# EAGLE board TX16S_enhanced (EAGLE 7.7.0), part 1 of 3
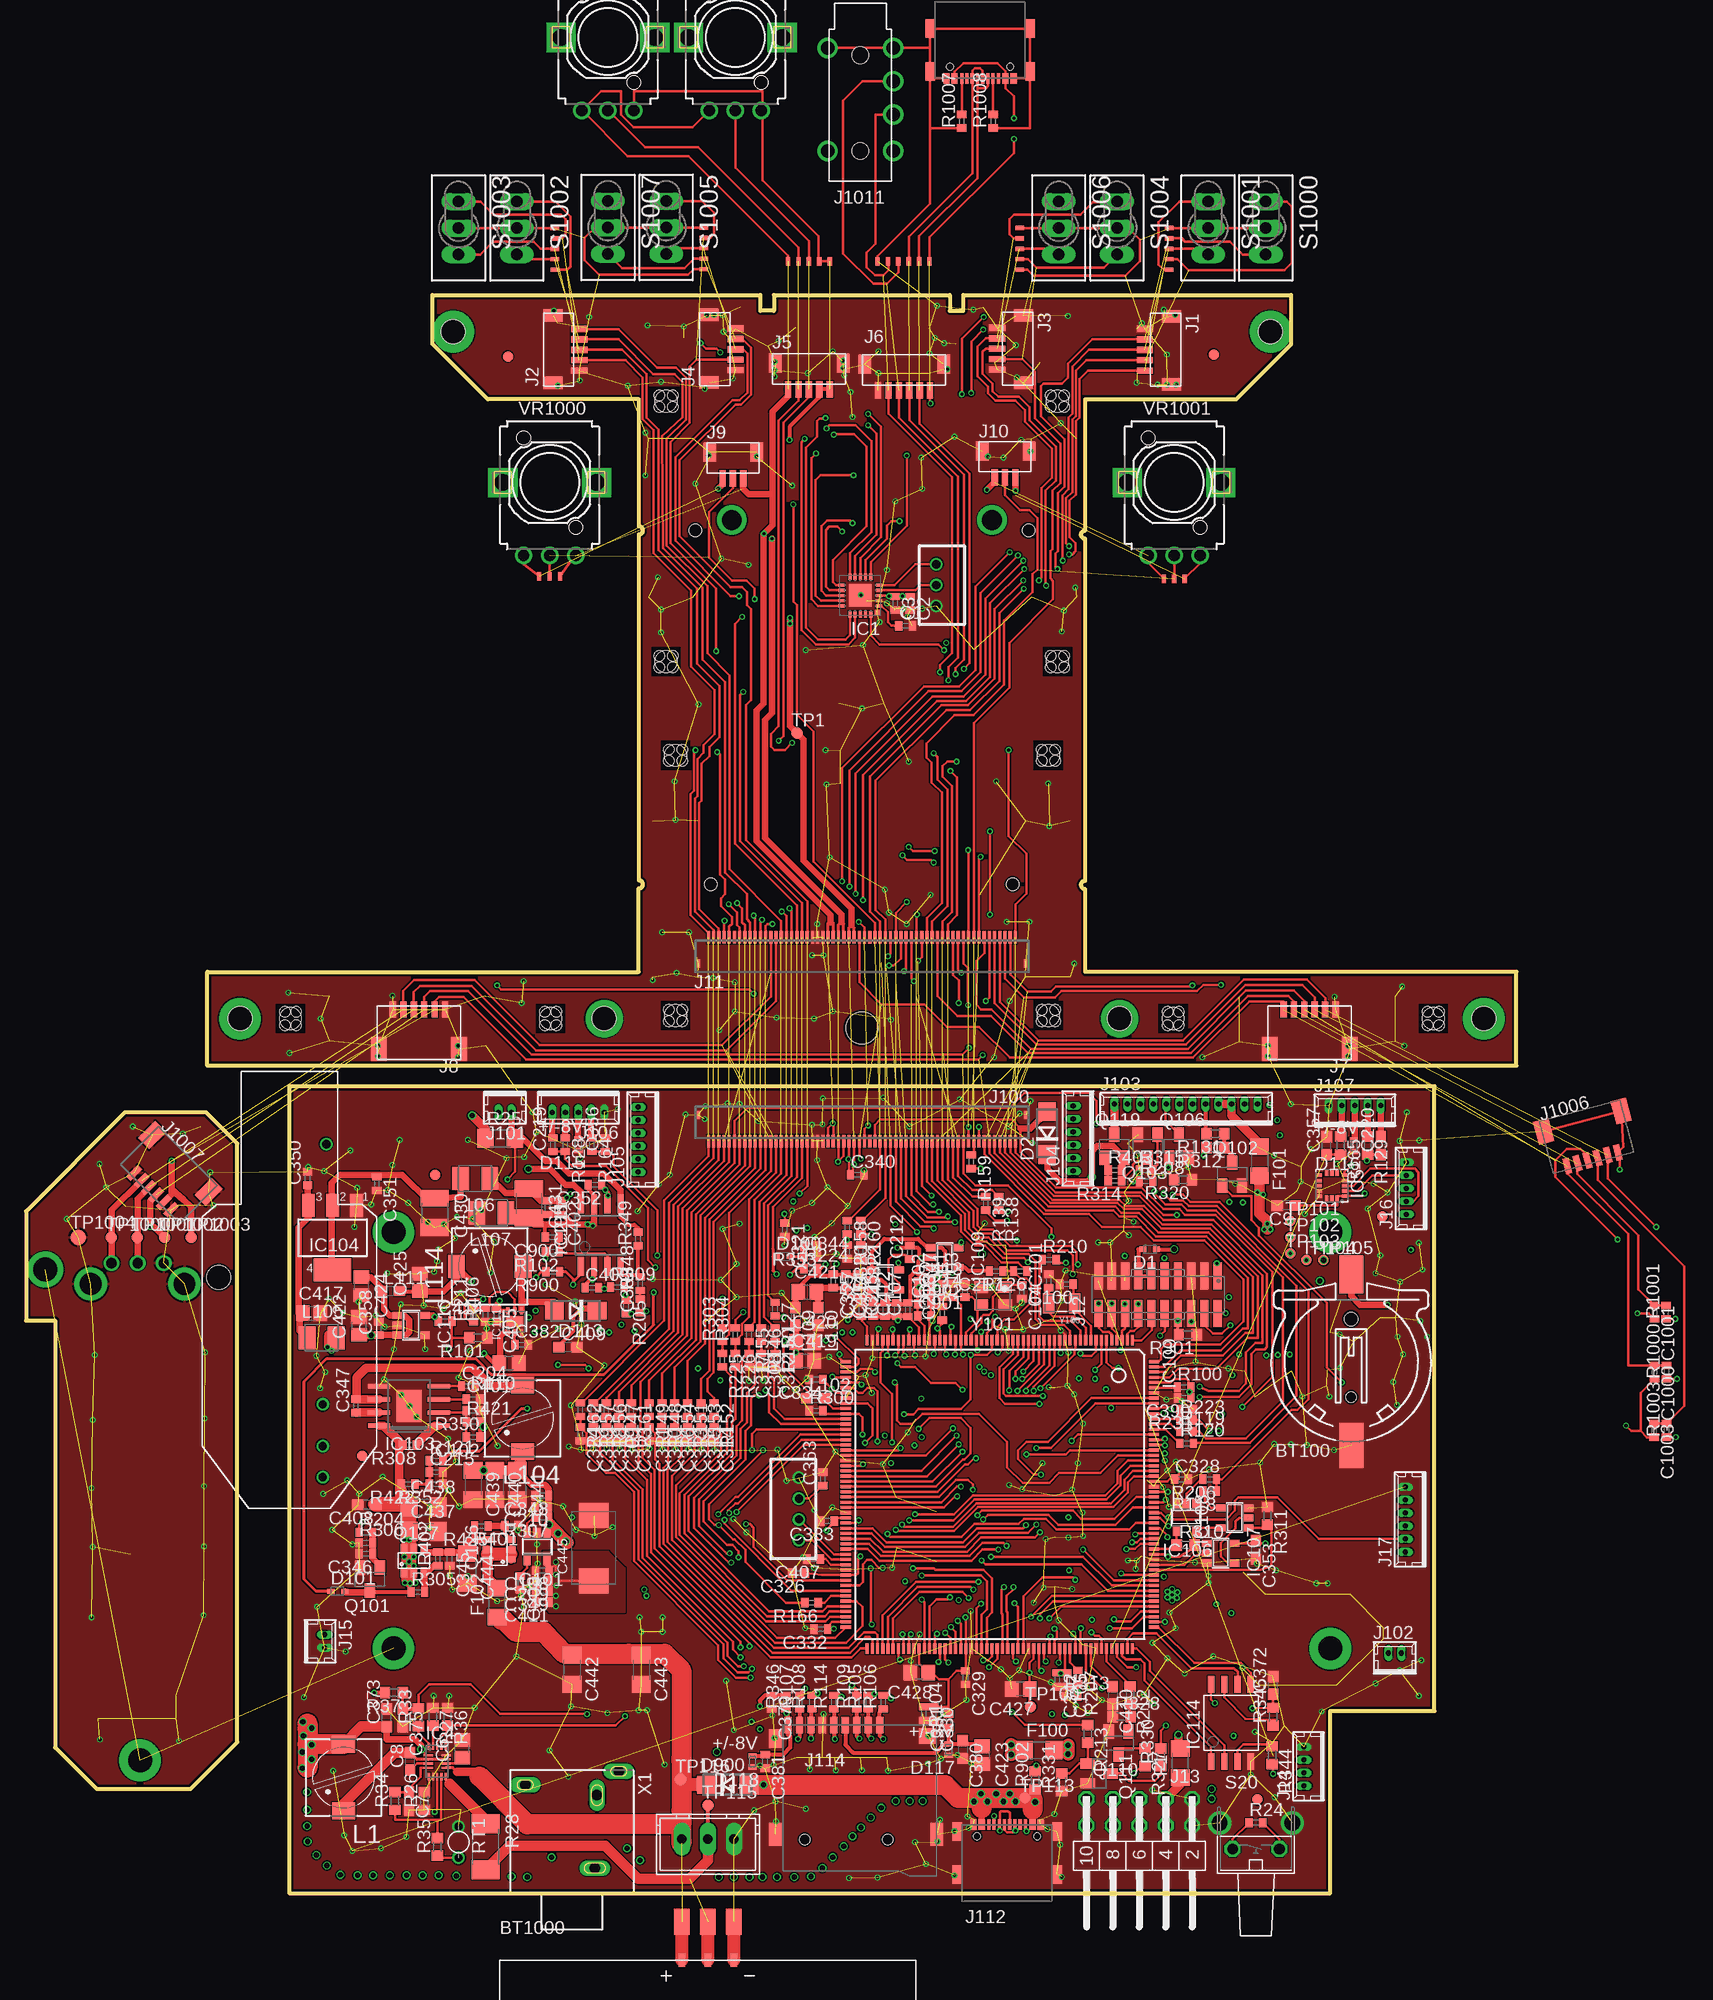
[diagram p5: board, top side]
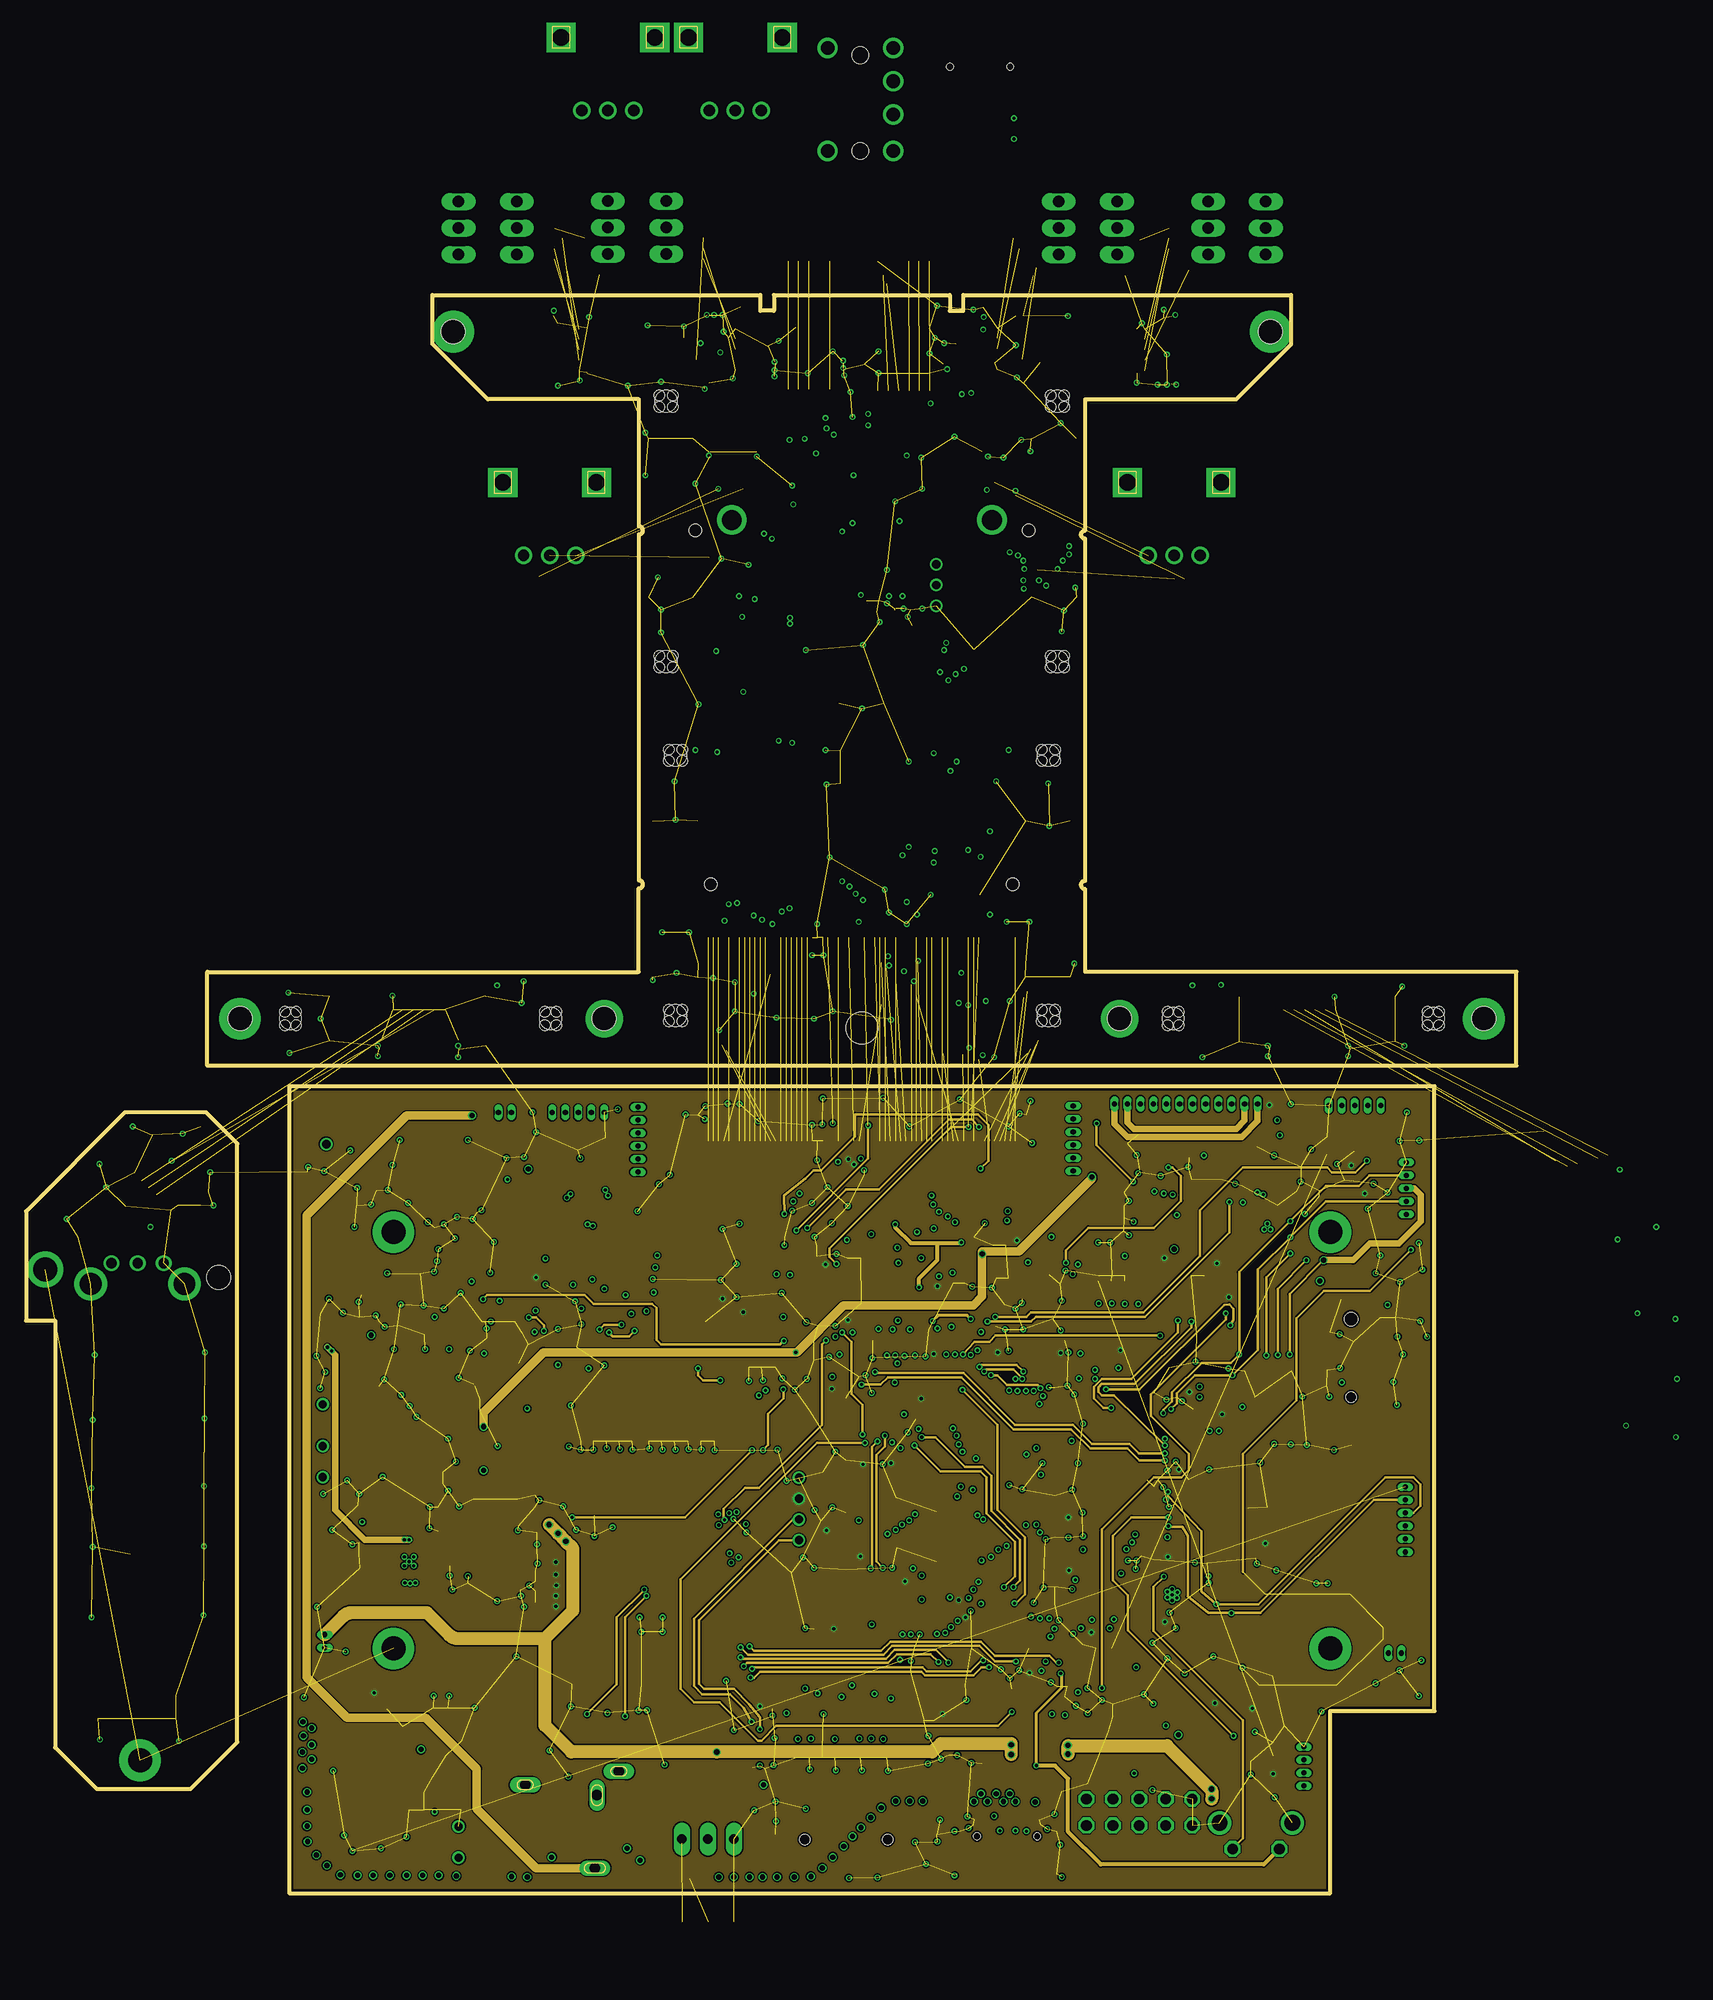
[diagram p6: board, inner layer Route2]
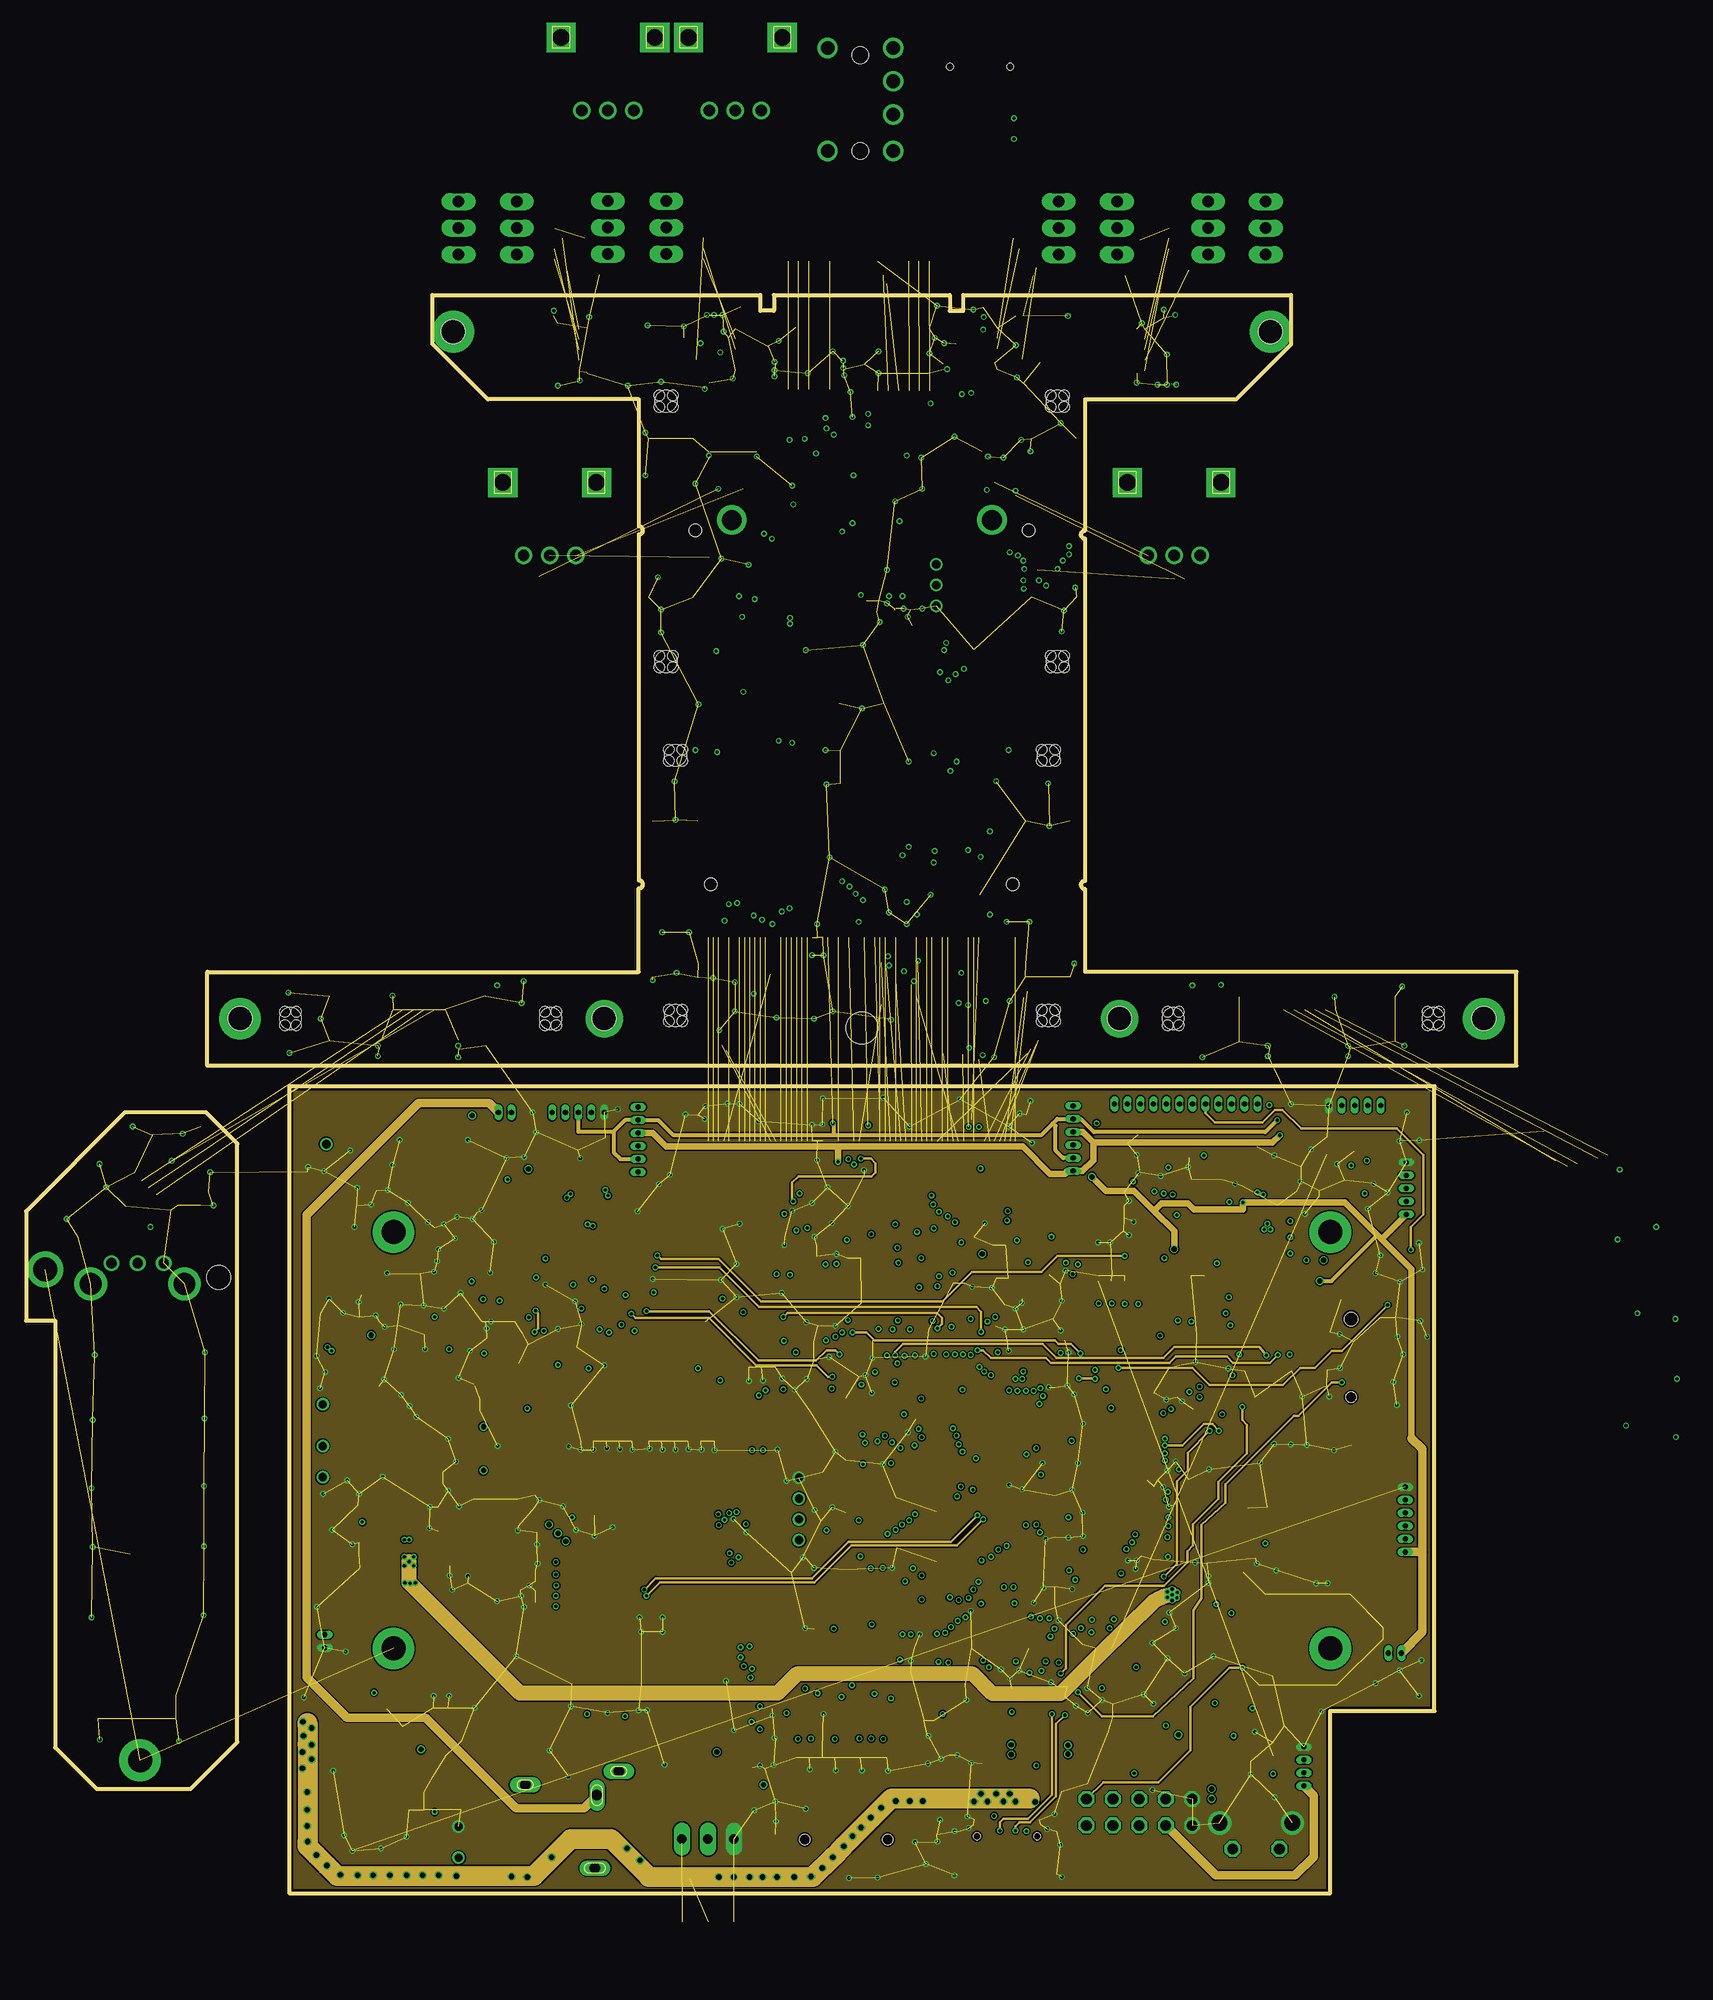
[diagram p7: board, inner layer Route3]
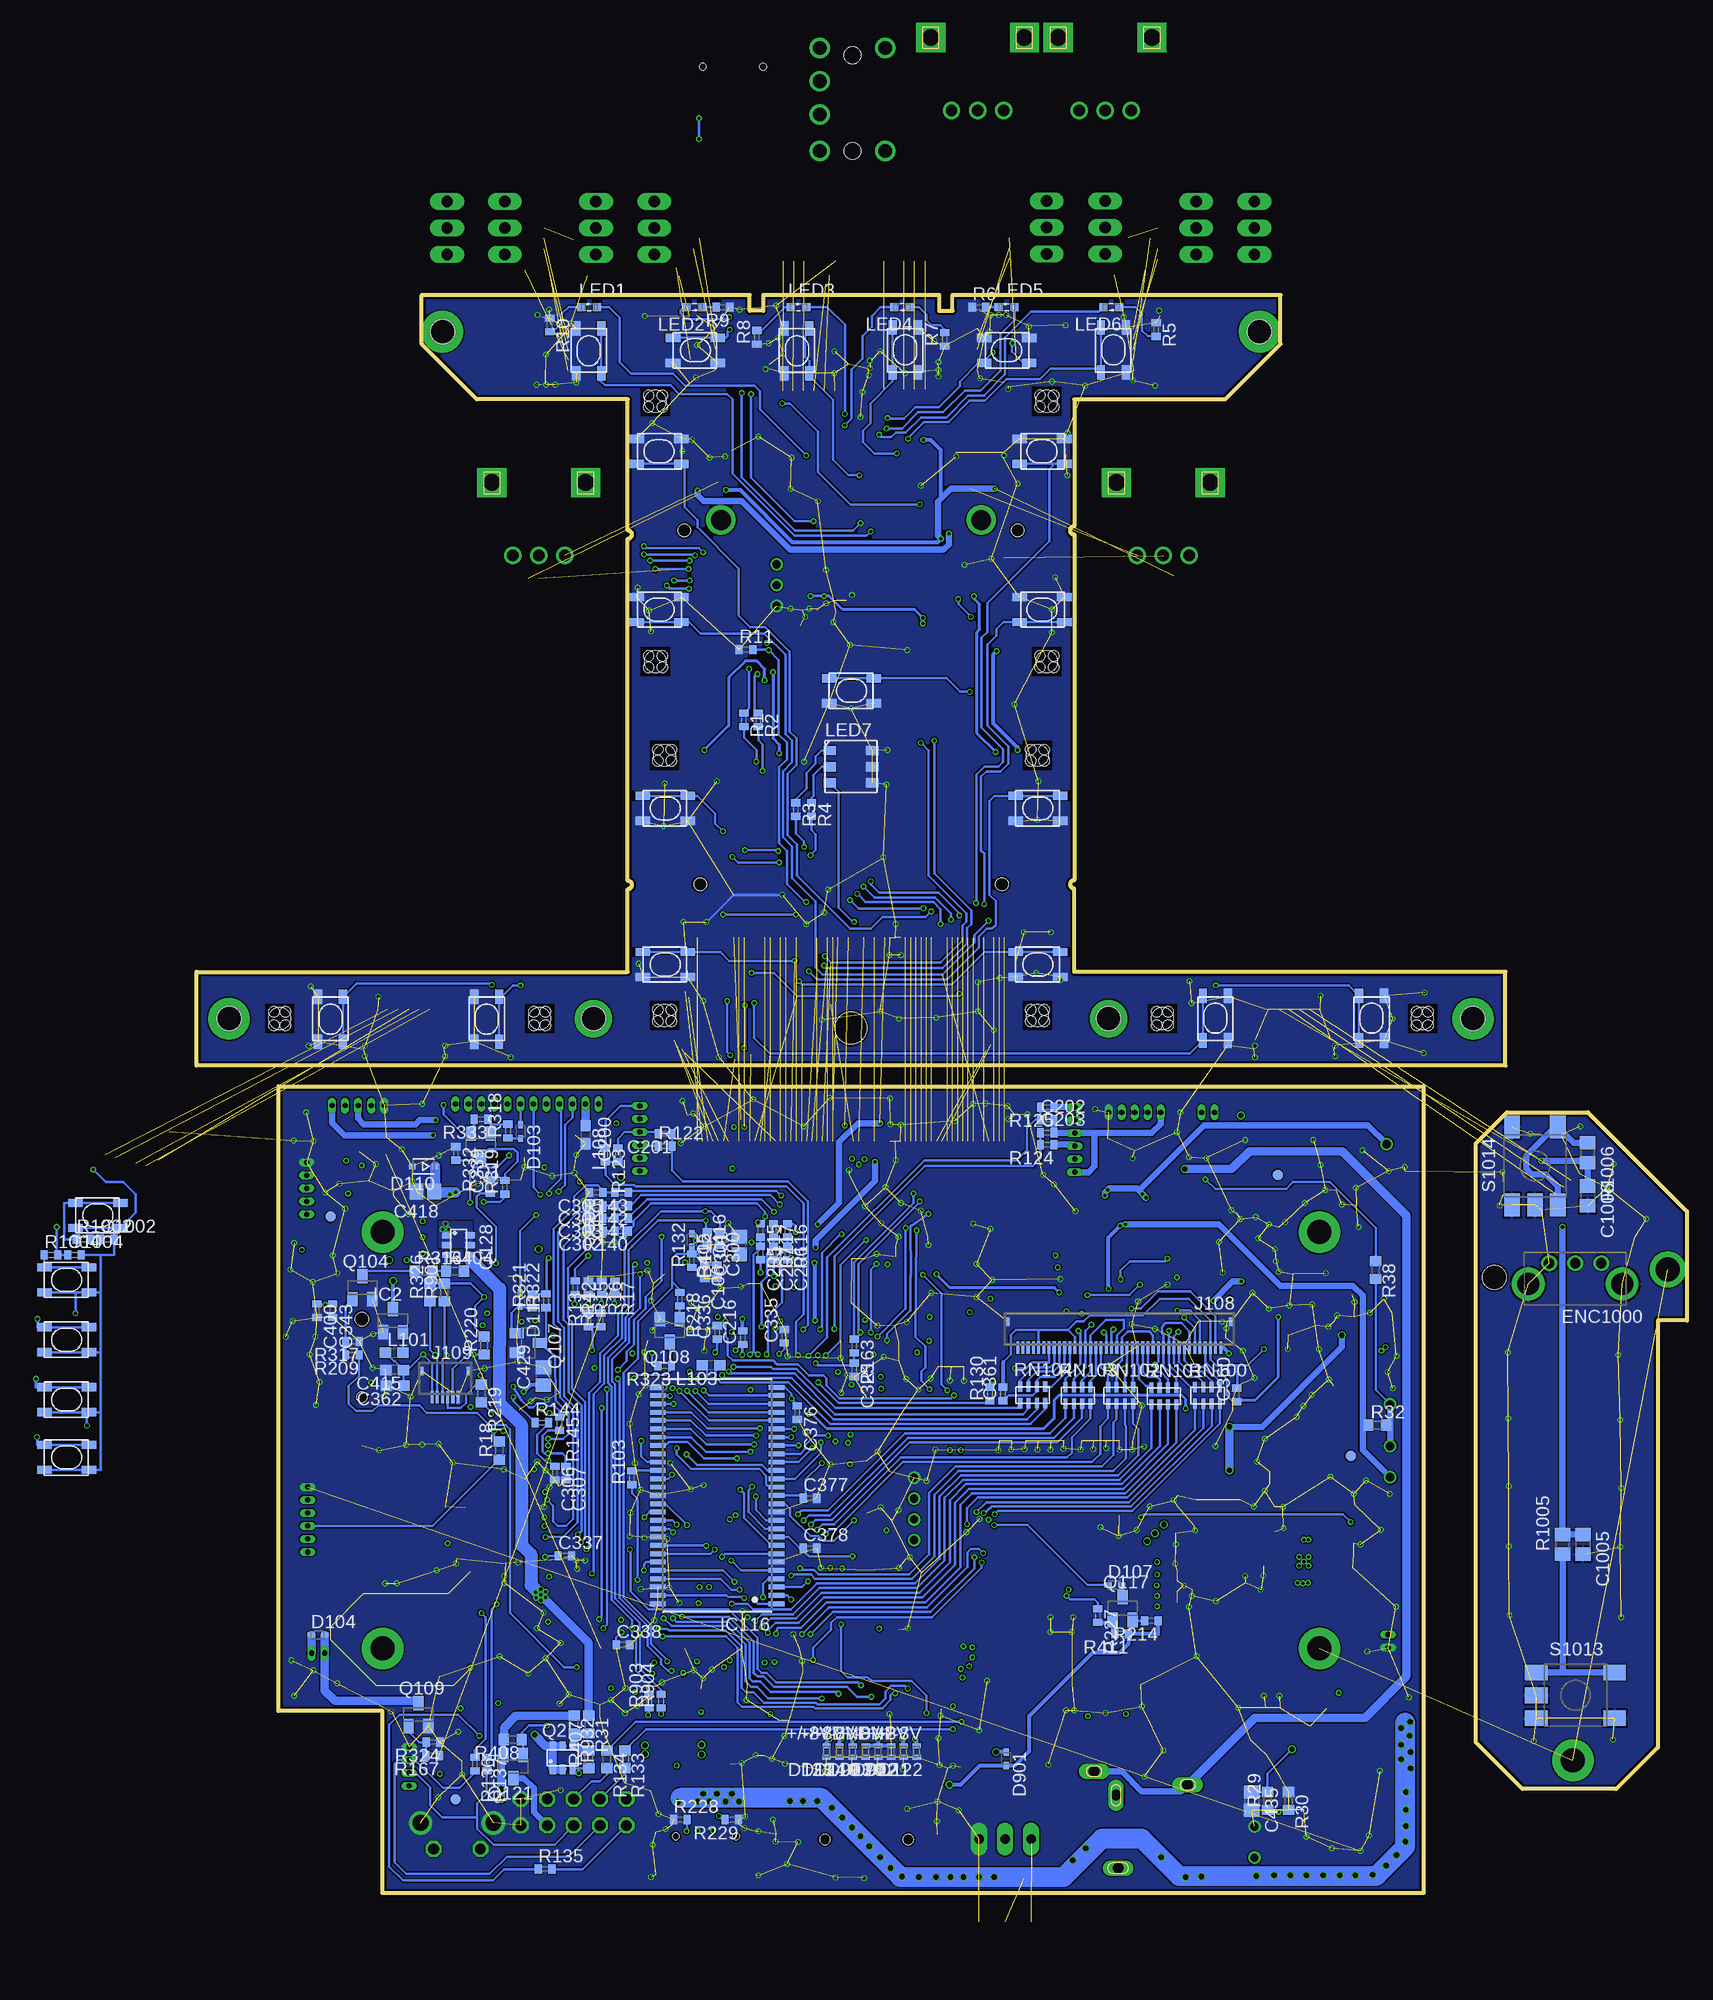
[diagram p8: board, bottom side, seen from below]

Size 143.18 x 153.5 mm. Coordinates in mm from the lower left corner, seen from the top.
Outline: 25.3,0 125.3,0 125.3,17.5 135.3,17.5 135.3,77.5 25.3,77.5 25.3,0
Outline: 17.43,79.5 143.18,79.5 143.18,88.5 101.75,88.5 101.75,96.45 arc-180 101.75,97.25 101.75,130.1 arc-180 101.75,130.9 101.75,143.5 116.25,143.5 121.55,148.8 121.55,153.5 90.05,153.5 90.05,152 88.75,152 88.75,153.5 71.85,153.5 71.85,152 70.55,152 70.55,153.5 39.05,153.5 39.05,148.8 44.35,143.5 58.85,143.5 58.85,131.3 arc-180 58.85,130.5 58.85,97.3 arc-180 58.85,96.5 58.85,88.5 17.43,88.5 17.43,79.5
Outline: 15.8,10 20.3,14.5 20.3,72 17.3,75 9.5,75 0,65.5 0,55 2.8,55 2.8,14 6.8,10 15.8,10
Copper layers (1+2*3+16): Top 0.035mm / dielectric 0.14mm / Route2 0.035mm / dielectric 1.2mm / Route3 0.035mm / dielectric 0.14mm / Bottom 0.035mm
Design rules "Multi-CB_4L_125um-Tracks_OL35um-IL35um *": minimum track width 0.125mm, minimum drill 0.2mm, track to track 0.125mm, track to pad 0.125mm, pad to pad 0.125mm, via to via 0.125mm, smd to smd 0mil, copper to edge 0.2mm, drill to drill 0.2mm, minimum pad ring 0.125mm, minimum via ring 0.125mm, stop-mask expansion 2mil, vias tented up to drill 0.45mm, thermal gap 0.2mm
Holes 2.3 mm at 20.55,84 55.55,84 105.05,84 140.05,84 41.05,150 119.55,150 18.5,59.15
Holes 2.1 mm at 25.4,84 50.4,84 110.2,84 135.2,84 62.4,84.3 62.4,109.3 98.2,84.3 98.2,109.3 61.5,118.3 61.5,143.3 99.1,118.3 99.1,143.3
Holes 3.1 mm at 80.3,83.1
Holes 1 mm at 24.85,84.65 25.95,84.65 25.95,83.35 24.85,83.35 49.85,84.65 49.85,83.35 50.95,84.65 50.95,83.35 109.65,84.65 109.65,83.35 110.75,84.65 110.75,83.35 134.65,84.65 134.65,83.35 135.75,83.35 135.75,84.65 61.75,83.75 61.75,84.85 63.05,84.85 63.05,83.75 98.85,84.85 98.85,83.75 97.55,84.85 97.55,83.75 61.75,109.85 63.05,109.85 61.75,108.75 63.05,108.75 97.55,109.85 97.55,108.75 98.85,109.85 98.85,108.75 60.85,118.85 60.85,117.75 62.15,118.85 62.15,117.75 98.45,118.85 98.45,117.75 99.75,117.75 99.75,118.85 60.85,143.85 60.85,142.75 62.15,143.85 62.15,142.75 98.45,143.85 98.45,142.75 99.75,143.85 99.75,142.75
Holes 1.2 mm at 64.3,130.9 96.3,130.9 65.8,96.9 94.8,96.9
tRestrict: area 24,82.6 to 26.8,85.4; area 133.8,82.6 to 136.6,85.4; area 49,82.6 to 51.8,85.4; area 108.8,82.6 to 111.6,85.4; area 61,82.9 to 63.8,85.7; area 96.8,82.9 to 99.6,85.7; area 61,107.9 to 63.8,110.7; area 96.8,107.9 to 99.6,110.7; area 60.1,116.9 to 62.9,119.7; area 97.7,116.9 to 100.5,119.7; area 60.1,141.9 to 62.9,144.7; area 97.7,141.9 to 100.5,144.7
bRestrict: area 24,82.6 to 26.8,85.4; area 133.8,82.6 to 136.6,85.4; area 49,82.6 to 51.8,85.4; area 108.8,82.6 to 111.6,85.4; area 61,82.9 to 63.8,85.7; area 96.8,82.9 to 99.6,85.7; area 61,107.9 to 63.8,110.7; area 96.8,107.9 to 99.6,110.7; area 60.1,116.9 to 62.9,119.7; area 97.7,116.9 to 100.5,119.7; area 60.1,141.9 to 62.9,144.7; area 97.7,141.9 to 100.5,144.7

## Footprints (pad centres in the part's own frame; a part is rotated, then mirrored left to right if it is on the bottom)
BT_KN330 = drill 0.8: +5V 3.55,35; GND 3.2,3; L 3.2,10; R 3.2,6
CH291-1220LF = smd 2.3 x 3.66: + 0,-2.296 | smd 2.3 x 4.3: - 0,14.146 | hole 1.3: 0,2 | hole 1: 0,9.5
BATTERY_2S_5000 = smd 0.635 x 1.27: 1 2.5,0; 2 0,0; 3 -2.5,0
C0402 = smd 0.7 x 0.9: 1 -0.65,0; 2 0.65,0
C2012 = smd 1.3 x 1.5: 1 -0.85,0; 2 0.85,0
C0603 = smd 1.1 x 1: 1 -0.85,0; 2 0.85,0
C3225 = smd 1.6 x 2.7: 1 -1.4,0; 2 1.4,0
C3216 = smd 1.6 x 1.8: 1 -1.4,0; 2 1.4,0
SMC_D = smd 2.4 x 2.8: + -3.15,0; - 3.15,0
C0805 = smd 1.3 x 1.5: 1 -0.95,0; 2 0.95,0
SOD523 = smd 0.7 x 0.5: A 0.7,0; C -0.6,0
DO-214AC = smd 1.8 x 1.7: A 2.05,0; C -2.05,0
SOD323-R = smd 0.6 x 0.6: A 1.1,0; C -1.1,0
DFN1006-2L = smd 0.8 x 0.5: P$1 0,0.55; P$2 0,-0.55
APLS_EC10E = drill 1: A -2.5,0; B 0,0; C 2.5,0 | drill 2.1: P$1 -4.5,2; P$2 4.5,2
1206 = smd 1.6 x 1.8: 1 -1.4,0; 2 1.4,0
FIDUCIAL = smd 1 x 1: P$1 0,0
MLP20 = smd 0.6 x 0.3: 1 -1.8,1; 2 -1.8,0.5; 3 -1.8,0; 4 -1.8,-0.5; 5 -1.8,-1; 11 1.8,-1; 12 1.8,-0.5; 13 1.8,0; 14 1.8,0.5; 15 1.8,1 | smd 0.3 x 0.6: 6 -1,-1.8; 7 -0.5,-1.8; 8 0,-1.8; 9 0.5,-1.8; 10 1,-1.8; 16 1,1.8; 17 0.5,1.8; 18 0,1.8; 19 -0.5,1.8; 20 -1,1.8 | smd 2.15 x 2.15: EXP 0,0 | smd 0.435 x 0.435: M -1.6,1.6
SOT-23 = smd 1 x 1.4: 1 -0.95,-1.1; 2 0.95,-1.1; 3 0,1.1
MP2672A = smd 0.889 x 0.203: 1 -0.85,0.6; 2 -0.85,0.2; 3 -0.85,-0.2; 4 -0.85,-0.6; 10 0.85,-0.6; 11 0.85,-0.2; 12 0.85,0.2; 13 0.85,0.6 | smd 0.203 x 0.711: 5 -0.8,-1.45; 6 -0.4,-1.45; 7 0,-1.45; 8 0.4,-1.45; 9 0.8,-1.45; 14 0.8,1.45; 15 0.4,1.45; 16 0,1.45; 17 -0.4,1.45; 18 -0.8,1.45
LGA_3X3_16L = smd 0.35 x 0.51: 1 1,1.21; 2 0.5,1.21; 3 0,1.21; 4 -0.5,1.21; 5 -1,1.21; 9 -1,-1.21; 10 -0.5,-1.21; 11 0,-1.21; 12 0.5,-1.21; 13 1,-1.21 | smd 0.51 x 0.35: 6 -1.21,0.5; 7 -1.21,0; 8 -1.21,-0.5; 14 1.21,-0.5; 15 1.21,0; 16 1.21,0.5
LQFP208 = smd 1 x 0.3: 1 -14.8,12.75; 2 -14.8,12.25; 3 -14.8,11.75; 4 -14.8,11.25; 5 -14.8,10.75; 6 -14.8,10.25; 7 -14.8,9.75; 8 -14.8,9.25; 9 -14.8,8.75; 10 -14.8,8.25; 11 -14.8,7.75; 12 -14.8,7.25; 13 -14.8,6.75; 14 -14.8,6.25; 15 -14.8,5.75; 16 -14.8,5.25; 17 -14.8,4.75; 18 -14.8,4.25; 19 -14.8,3.75; 20 -14.8,3.25; 21 -14.8,2.75; 22 -14.8,2.25; 23 -14.8,1.75; 24 -14.8,1.25; 25 -14.8,0.75; 26 -14.8,0.25; 27 -14.8,-0.25; 28 -14.8,-0.75; 29 -14.8,-1.25; 30 -14.8,-1.75; 31 -14.8,-2.25; 32 -14.8,-2.75; 33 -14.8,-3.25; 34 -14.8,-3.75; 35 -14.8,-4.25; 36 -14.8,-4.75; 37 -14.8,-5.25; 38 -14.8,-5.75; 39 -14.8,-6.25; 40 -14.8,-6.75; 41 -14.8,-7.25; 42 -14.8,-7.75; 43 -14.8,-8.25; 44 -14.8,-8.75; 45 -14.8,-9.25; 46 -14.8,-9.75; 47 -14.8,-10.25; 48 -14.8,-10.75; 49 -14.8,-11.25; 50 -14.8,-11.75; 51 -14.8,-12.25; 52 -14.8,-12.75; 105 14.8,-12.75; 106 14.8,-12.25; 107 14.8,-11.75; 108 14.8,-11.25; 109 14.8,-10.75; 110 14.8,-10.25; 111 14.8,-9.75; 112 14.8,-9.25; 113 14.8,-8.75; 114 14.8,-8.25; 115 14.8,-7.75; 116 14.8,-7.25; 117 14.8,-6.75; 118 14.8,-6.25; 119 14.8,-5.75; 120 14.8,-5.25; 121 14.8,-4.75; 122 14.8,-4.25; 123 14.8,-3.75; 124 14.8,-3.25; 125 14.8,-2.75; 126 14.8,-2.25; 127 14.8,-1.75; 128 14.8,-1.25; 129 14.8,-0.75; 130 14.8,-0.25; 131 14.8,0.25; 132 14.8,0.75; 133 14.8,1.25; 134 14.8,1.75; 135 14.8,2.25; 136 14.8,2.75; 137 14.8,3.25; 138 14.8,3.75; 139 14.8,4.25; 140 14.8,4.75; 141 14.8,5.25; 142 14.8,5.75; 143 14.8,6.25; 144 14.8,6.75; 145 14.8,7.25; 146 14.8,7.75; 147 14.8,8.25; 148 14.8,8.75; 149 14.8,9.25; 150 14.8,9.75; 151 14.8,10.25; 152 14.8,10.75; 153 14.8,11.25; 154 14.8,11.75; 155 14.8,12.25; 156 14.8,12.75 | smd 0.3 x 1: 53 -12.75,-14.8; 54 -12.25,-14.8; 55 -11.75,-14.8; 56 -11.25,-14.8; 57 -10.75,-14.8; 58 -10.25,-14.8; 59 -9.75,-14.8; 60 -9.25,-14.8; 61 -8.75,-14.8; 62 -8.25,-14.8; 63 -7.75,-14.8; 64 -7.25,-14.8; 65 -6.75,-14.8; 66 -6.25,-14.8; 67 -5.75,-14.8; 68 -5.25,-14.8; 69 -4.75,-14.8; 70 -4.25,-14.8; 71 -3.75,-14.8; 72 -3.25,-14.8; 73 -2.75,-14.8; 74 -2.25,-14.8; 75 -1.75,-14.8; 76 -1.25,-14.8; 77 -0.75,-14.8; 78 -0.25,-14.8; 79 0.25,-14.8; 80 0.75,-14.8; 81 1.25,-14.8; 82 1.75,-14.8; 83 2.25,-14.8; 84 2.75,-14.8; 85 3.25,-14.8; 86 3.75,-14.8; 87 4.25,-14.8; 88 4.75,-14.8; 89 5.25,-14.8; 90 5.75,-14.8; 91 6.25,-14.8; 92 6.75,-14.8; 93 7.25,-14.8; 94 7.75,-14.8; 95 8.25,-14.8; 96 8.75,-14.8; 97 9.25,-14.8; 98 9.75,-14.8; 99 10.25,-14.8; 100 10.75,-14.8; 101 11.25,-14.8; 102 11.75,-14.8; 103 12.25,-14.8; 104 12.75,-14.8; 157 12.75,14.8; 158 12.25,14.8; 159 11.75,14.8; 160 11.25,14.8; 161 10.75,14.8; 162 10.25,14.8; 163 9.75,14.8; 164 9.25,14.8; 165 8.75,14.8; 166 8.25,14.8; 167 7.75,14.8; 168 7.25,14.8; 169 6.75,14.8; 170 6.25,14.8; 171 5.75,14.8; 172 5.25,14.8; 173 4.75,14.8; 174 4.25,14.8; 175 3.75,14.8; 176 3.25,14.8; 177 2.75,14.8; 178 2.25,14.8; 179 1.75,14.8; 180 1.25,14.8; 181 0.75,14.8; 182 0.25,14.8; 183 -0.25,14.8; 184 -0.75,14.8; 185 -1.25,14.8; 186 -1.75,14.8; 187 -2.25,14.8; 188 -2.75,14.8; 189 -3.25,14.8; 190 -3.75,14.8; 191 -4.25,14.8; 192 -4.75,14.8; 193 -5.25,14.8; 194 -5.75,14.8; 195 -6.25,14.8; 196 -6.75,14.8; 197 -7.25,14.8; 198 -7.75,14.8; 199 -8.25,14.8; 200 -8.75,14.8; 201 -9.25,14.8; 202 -9.75,14.8; 203 -10.25,14.8; 204 -10.75,14.8; 205 -11.25,14.8; 206 -11.75,14.8; 207 -12.25,14.8; 208 -12.75,14.8
SOT23-5 = smd 0.69 x 0.99: 1 -0.95,-1.29; 2 0,-1.29; 3 0.95,-1.29; 4 0.95,1.3; 5 -0.95,1.3
HSOP-8 = smd 0.45 x 2.15: 1 -1.905,-2.875; 2 -0.635,-2.875; 3 0.635,-2.875; 4 1.905,-2.875; 5 1.905,2.875; 6 0.635,2.875; 7 -0.635,2.875; 8 -1.905,2.875 | smd 3.1 x 2.4: PAD 0,0
SOT-223 = smd 1.219 x 2.235: 1 -2.311,-3.099; 2 0,-3.099; 3 2.311,-3.099 | smd 3.6 x 2.2: 4 0,3.099
SOP-8 = smd 0.6 x 1.8: 1 -1.905,-3; 2 -0.635,-3; 3 0.635,-3; 4 1.905,-3; 5 1.905,3; 6 0.635,3; 7 -0.635,3; 8 -1.905,3
WSON6 = smd 0.32 x 0.66: 1 -0.65,-1.025; 2 0,-1.025; 3 0.65,-1.025; 4 0.65,1.025; 5 0,1.025; 6 -0.65,1.025 | smd 1.6 x 1: PAD 0,0
SOP-8_208MIL = smd 0.61 x 1.6: 1 -1.905,-3.7; 2 -0.635,-3.7; 3 0.635,-3.7; 4 1.905,-3.7; 5 1.905,3.7; 6 0.635,3.7; 7 -0.635,3.7; 8 -1.905,3.7
TSOP_II_54 = smd 0.477 x 1.517: 1 -10.4,-5.705; 2 -9.6,-5.705; 3 -8.8,-5.705; 4 -8,-5.705; 5 -7.2,-5.705; 6 -6.4,-5.705; 7 -5.6,-5.705; 8 -4.8,-5.705; 9 -4,-5.705; 10 -3.2,-5.705; 11 -2.4,-5.705; 12 -1.6,-5.705; 13 -0.8,-5.705; 14 0,-5.705; 15 0.8,-5.705; 16 1.6,-5.705; 17 2.4,-5.705; 18 3.2,-5.705; 19 4,-5.705; 20 4.8,-5.705; 21 5.6,-5.705; 22 6.4,-5.705; 23 7.2,-5.705; 24 8,-5.705; 25 8.8,-5.705; 26 9.6,-5.705; 27 10.4,-5.705; 28 10.4,5.705; 29 9.6,5.705; 30 8.8,5.705; 31 8,5.705; 32 7.2,5.705; 33 6.4,5.705; 34 5.6,5.705; 35 4.8,5.705; 36 4,5.705; 37 3.2,5.705; 38 2.4,5.705; 39 1.6,5.705; 40 0.8,5.705; 41 0,5.705; 42 -0.8,5.705; 43 -1.6,5.705; 44 -2.4,5.705; 45 -3.2,5.705; 46 -4,5.705; 47 -4.8,5.705; 48 -5.6,5.705; 49 -6.4,5.705; 50 -7.2,5.705; 51 -8,5.705; 52 -8.8,5.705; 53 -9.6,5.705; 54 -10.4,5.705
AT_1SH-A-05-XS = smd 0.6 x 1.55: 1 -2,-2; 2 -1,-2; 3 0,-2; 4 1,-2; 5 2,-2 | smd 1.2 x 1.8: G1 -3.2,0.525; G2 3.3,0.525
AT_1SH-A-06-XS = smd 0.6 x 1.55: 1 -2.5,-2; 2 -1.5,-2; 3 -0.5,-2; 4 0.5,-2; 5 1.5,-2; 6 2.5,-2 | smd 1.2 x 1.8: G1 -3.8,0.525; G2 3.8,0.525
AT_1SH-A-06-XR = smd 0.6 x 1.55: 1 -2.5,-2.275; 2 -1.5,-2.275; 3 -0.5,-2.275; 4 0.5,-2.275; 5 1.5,-2.275; 6 2.5,-2.275 | smd 1.5 x 2.3: G1 -3.85,1.5; G2 3.85,1.5
AT_1SH-A-03-XS = smd 0.6 x 1.55: 1 -1,-1; 2 0,-1; 3 1,-1 | smd 1.2 x 1.8: G1 -2.2,1.525; G2 2.3,1.525
CON-FFC-60-REV = smd 0.3 x 1.2: 1 14.75,1.8; 2 14.25,1.8; 3 13.75,1.8; 4 13.25,1.8; 5 12.75,1.8; 6 12.25,1.8; 7 11.75,1.8; 8 11.25,1.8; 9 10.75,1.8; 10 10.25,1.8; 11 9.75,1.8; 12 9.25,1.8; 13 8.75,1.8; 14 8.25,1.8; 15 7.75,1.8; 16 7.25,1.8; 17 6.75,1.8; 18 6.25,1.8; 19 5.75,1.8; 20 5.25,1.8; 21 4.75,1.8; 22 4.25,1.8; 23 3.75,1.8; 24 3.25,1.8; 25 2.75,1.8; 26 2.25,1.8; 27 1.75,1.8; 28 1.25,1.8; 29 0.75,1.8; 30 0.25,1.8; 31 -0.25,1.8; 32 -0.75,1.8; 33 -1.25,1.8; 34 -1.75,1.8; 35 -2.25,1.8; 36 -2.75,1.8; 37 -3.25,1.8; 38 -3.75,1.8; 39 -4.25,1.8; 40 -4.75,1.8; 41 -5.25,1.8; 42 -5.75,1.8; 43 -6.25,1.8; 44 -6.75,1.8; 45 -7.25,1.8; 46 -7.75,1.8; 47 -8.25,1.8; 48 -8.75,1.8; 49 -9.25,1.8; 50 -9.75,1.8; 51 -10.25,1.8; 52 -10.75,1.8; 53 -11.25,1.8; 54 -11.75,1.8; 55 -12.25,1.8; 56 -12.75,1.8; 57 -13.25,1.8; 58 -13.75,1.8; 59 -14.25,1.8; 60 -14.75,1.8 | smd 0.4 x 0.8: G1 -15.75,-0.7; G2 15.75,-0.7
FTSH-110 = smd 0.8 x 2.6: 1 5.715,1.8; 2 5.715,-1.8; 3 4.445,1.8; 4 4.445,-1.8; 5 3.175,1.8; 6 3.175,-1.8; 7 1.905,1.8; 8 1.905,-1.8; 9 0.635,1.8; 10 0.635,-1.8; 11 -0.635,1.8; 12 -0.635,-1.8; 13 -1.905,1.8; 14 -1.905,-1.8; 15 -3.175,1.8; 16 -3.175,-1.8; 17 -4.445,1.8; 18 -4.445,-1.8; 19 -5.715,1.8; 20 -5.715,-1.8
PH2.54-5W2 = drill 1.016 octagon: 1 -5.08,0; 2 -5.08,-2.54; 3 -2.54,0; 4 -2.54,-2.54; 5 0,0; 6 0,-2.54; 7 2.54,0; 8 2.54,-2.54; 9 5.08,0; 10 5.08,-2.54
MOLEX_53047-04 = drill 0.5 pad 0.698 long: 1 1.845,0; 2 0.595,0; 3 -0.655,0; 4 -1.905,0
MOLEX_53047-02 = drill 0.5 pad 0.698 long: 1 0.625,0; 2 -0.625,0
MOLEX_53047-05 = drill 0.5 pad 0.698 long: 1 2.5,0; 2 1.25,0; 3 0,0; 4 -1.25,0; 5 -2.5,0
MOLEX_53047-06 = drill 0.5 pad 0.698 long: 1 3.115,0; 2 1.865,0; 3 0.615,0; 4 -0.635,0; 5 -1.885,0; 6 -3.135,0
JST_B3B_PH-K-S = drill 0.8: 1 -2,0; 2 0,0; 3 2,0
CON-FFC-60 = smd 0.3 x 1.2: 1 -14.75,1.8; 2 -14.25,1.8; 3 -13.75,1.8; 4 -13.25,1.8; 5 -12.75,1.8; 6 -12.25,1.8; 7 -11.75,1.8; 8 -11.25,1.8; 9 -10.75,1.8; 10 -10.25,1.8; 11 -9.75,1.8; 12 -9.25,1.8; 13 -8.75,1.8; 14 -8.25,1.8; 15 -7.75,1.8; 16 -7.25,1.8; 17 -6.75,1.8; 18 -6.25,1.8; 19 -5.75,1.8; 20 -5.25,1.8; 21 -4.75,1.8; 22 -4.25,1.8; 23 -3.75,1.8; 24 -3.25,1.8; 25 -2.75,1.8; 26 -2.25,1.8; 27 -1.75,1.8; 28 -1.25,1.8; 29 -0.75,1.8; 30 -0.25,1.8; 31 0.25,1.8; 32 0.75,1.8; 33 1.25,1.8; 34 1.75,1.8; 35 2.25,1.8; 36 2.75,1.8; 37 3.25,1.8; 38 3.75,1.8; 39 4.25,1.8; 40 4.75,1.8; 41 5.25,1.8; 42 5.75,1.8; 43 6.25,1.8; 44 6.75,1.8; 45 7.25,1.8; 46 7.75,1.8; 47 8.25,1.8; 48 8.75,1.8; 49 9.25,1.8; 50 9.75,1.8; 51 10.25,1.8; 52 10.75,1.8; 53 11.25,1.8; 54 11.75,1.8; 55 12.25,1.8; 56 12.75,1.8; 57 13.25,1.8; 58 13.75,1.8; 59 14.25,1.8; 60 14.75,1.8 | smd 0.4 x 0.8: G1 -15.75,-0.7; G2 15.75,-0.7
MOLEX_53047-12 = drill 0.5 pad 0.698 long: 1 6.865,0; 2 5.615,0; 3 4.365,0; 4 3.115,0; 5 1.865,0; 6 0.615,0; 7 -0.635,0; 8 -1.885,0; 9 -3.135,0; 10 -4.385,0; 11 -5.635,0; 12 -6.885,0
CON-FFC-40 = smd 0.3 x 1.2: 1 -9.67,1.8; 2 -9.17,1.8; 3 -8.67,1.8; 4 -8.17,1.8; 5 -7.67,1.8; 6 -7.17,1.8; 7 -6.67,1.8; 8 -6.17,1.8; 9 -5.67,1.8; 10 -5.17,1.8; 11 -4.67,1.8; 12 -4.17,1.8; 13 -3.67,1.8; 14 -3.17,1.8; 15 -2.67,1.8; 16 -2.17,1.8; 17 -1.67,1.8; 18 -1.17,1.8; 19 -0.67,1.8; 20 -0.17,1.8; 21 0.33,1.8; 22 0.83,1.8; 23 1.33,1.8; 24 1.83,1.8; 25 2.33,1.8; 26 2.83,1.8; 27 3.33,1.8; 28 3.83,1.8; 29 4.33,1.8; 30 4.83,1.8; 31 5.33,1.8; 32 5.83,1.8; 33 6.33,1.8; 34 6.83,1.8; 35 7.33,1.8; 36 7.83,1.8; 37 8.33,1.8; 38 8.83,1.8; 39 9.33,1.8; 40 9.83,1.8 | smd 0.4 x 0.8: G1 -10.67,-0.7; G2 10.83,-0.7
CON-FFC-6 = smd 0.3 x 1.2: 1 -1.25,1.8; 2 -0.75,1.8; 3 -0.25,1.8; 4 0.25,1.8; 5 0.75,1.8; 6 1.25,1.8 | smd 0.4 x 0.8: G1 -2.25,-0.7; G2 2.25,-0.7
USB-C-16 = smd 0.3 x 1: A5 -1.25,3.47; A6 -0.25,3.47; A7 0.25,3.47; A8 1.25,3.47; B5 1.75,3.47; B6 0.75,3.47; B7 -0.75,3.47; B8 -1.75,3.47 | smd 0.914 x 1.778: G1 -4.8,-1.3; G2 -4.8,2.8; G3 4.8,-1.3; G4 4.8,2.8 | smd 0.6 x 1: GND -3.225,3.47; GND2 3.225,3.47; VBUS1 -2.45,3.47; VBUS2 2.45,3.47 | hole 0.65: -2.89,2.365; 2.89,2.365
JST_B3B-XH-A = drill 0.9 pad 1.6 long: 1 2.5,0; 2 0,0; 3 -2.5,0
TFWF1 = smd 0.7 x 1.6: 1 7.2,11; 2 6.1,11; 3 5,11; 4 3.9,11; 5 2.8,11; 6 1.7,11; 7 0.6,11; 8 -0.5,11; CD -1.6,11 | smd 1.2 x 1.8: G1 -2.8,9.7 | smd 1.6 x 1.5: G2 11.8,9.95 | smd 1.2 x 2.2: G3 -2.8,0.5; G4 12.7,0.5 | hole 1: 0,0; 8,0
JST_B4B_PH-K-S = drill 0.8: 1 -3,0; 2 -1,0; 3 1,0; 4 3,0
PADS_5_1MM = smd 0.406 x 0.813: 1 -2,0; 2 -1,0; 3 0,0; 4 1,0; 5 2,0
PADS_6_1MM = smd 0.406 x 0.813: 1 -2.5,0; 2 -1.5,0; 3 -0.5,0; 4 0.5,0; 5 1.5,0; 6 2.5,0
AT_1SH-A-06-XR-REV = smd 0.6 x 1.55: 1 2.5,-2.275; 2 1.5,-2.275; 3 0.5,-2.275; 4 -0.5,-2.275; 5 -1.5,-2.275; 6 -2.5,-2.275 | smd 1.5 x 2.3: G1 -3.85,1.5; G2 3.85,1.5
PADS_3_1MM = smd 0.406 x 0.813: 1 -1,0; 2 0,0; 3 1,0
PJ-313B = drill 1.3: 2A -3.15,9.9; 2B 3.15,9.9; 3 3.15,6.7; 4 3.15,3.5; 5A -3.15,0; 5B 3.15,0 | hole 1.6: 0,0; 0,9.2
JST_XHP-3 = smd 1.5 x 2.5: 1 -2.5,0; 2 0,0; 3 2.5,0
PIS2816 = smd 2.2 x 1.6: 1 0,3.2; 2 0,-3.2
0603 = smd 1.1 x 1: 1 -0.85,0; 2 0.85,0
L3225M = smd 1.6 x 2.2: 1 -1.4,0; 2 1.4,0
SML0603 = smd 0.8 x 0.8: A 0.75,0; C -0.75,0
PLCC-6 = smd 1.2 x 0.9: AB -2.05,1.55; AG -2.05,-1.55; AR -2.05,0; CB 2.05,1.55; CG 2.05,-1.55; CR 2.05,0
TSOP-6 = smd 0.6 x 0.95: 1 -0.95,-1.125; 2 0,-1.125; 3 0.95,-1.125; 4 0.95,1.125; 5 0,1.125; 6 -0.95,1.125
R0402 = smd 0.7 x 0.9: 1 -0.65,0; 2 0.65,0
R0603 = smd 1 x 1.1: 1 -0.85,0; 2 0.85,0
R1206 = smd 1.6 x 1.803: 1 -1.422,0; 2 1.422,0
R2010 = smd 1.8 x 2.7: 1 -2.2,0; 2 2.2,0
R0805 = smd 1.3 x 1.5: 1 -0.95,0; 2 0.95,0
EXB38V = smd 0.4 x 1: 1A 1.2,-0.8; 1B 1.2,0.8; 2A 0.4,-0.8; 2B 0.4,0.8; 3A -0.4,-0.8; 3B -0.4,0.8; 4A -1.2,-0.8; 4B -1.2,0.8
NTC_3MM = drill 0.8: P$1 -1.5,0; P$2 1.5,0
TX16S_BUTTON = smd 0.8 x 1.4: 1.1 -1.2,2.1; 1.2 -1.2,-2.2; 2.1 1.2,2.1; 2.2 1.2,-2.2
JTP1236B = drill 1.016 octagon: 1 -2.25,-2.5; 2 2.25,-2.5 | drill 1.499 pad 2.159: SH1 -3.5,0; SH2 3.5,0
TL3XPO = drill 1.1 pad 1.422 long: 1 -2.54,0; 2 0,0; 3 2.54,0
TX16S_BUTTON2 = smd 1.5 x 2.2: 1.1 -2.2,3.75; 1.2 -2.2,-3.75; 2.1 2.2,3.75; 2.2 2.2,-3.75; SH 0,-3.75
TP11R = smd 1.1 x 1.1: TP 0,0
TP10R = smd 1 x 1: TP 0,0
TP15R = smd 1.5 x 1.5: TP 0,0
EVUFXL = drill 1.1 pad 1.676: 1 -2.5,-7; 2 0,-7; 3 2.5,-7 | drill 1.6 pad 2.8 square: M1 4.5,0; M2 -4.5,0
KLBR4 = drill 1 pad 1.3 long: B -2.4,-3.5; S -2.2,3.5 | drill 1 pad 1.2 long: R -4.5,-5.8; T 4.5,-4.5
3215 = smd 1.1 x 1.9: 1 -1.25,0; 2 1.25,0
3225 = smd 1.3 x 1.1: 1 -1.15,-0.9; 2 1.15,-0.9; 3 1.15,0.8; 4 -1.15,0.8

## Placement (x,y rotation side)
A1  BT_KN330  [BT_KN330]  25.3,36.95 0 top
BT100  CR1220 coin cell  [CH291-1220LF]  127.3,57.15 180 top
BT1000  2 Cell Lithium Battery  [BATTERY_2S_5000]  65.5,-6.45 0 top  (outside the outline)
C1  100n  [C0402]  84.5,121.75 0 top
C2  100n  [C0402]  84.95,123.9 270 top
C3  10u  [C0402]  83.5,123.9 270 top
C6  4u7 LESR  [C2012]  41.9,13.85 90 top
C7  1u  [C0603]  36.8,8.85 270 top
C8  100n  [C0603]  36.9,12.65 90 top
C9  100n  [C0603]  121.05,66.05 180 top
C100  15p  [C0402]  99.95,58.5 180 top
C101  15p  [C0402]  98.25,58.8 90 top
C102  15p  [C0402]  42.95,43.8 180 top
C103  22p  [C0402]  90.2,57.9 90 top
C104  22p  [C0402]  95.65,57.75 270 top
C105  100p  [C0402]  100,20.5 270 top
C106  100p  [C0402]  94.35,59.7 270 bottom
C107  100p  [C0402]  84.7,56.05 90 top
C108  100p  [C0402]  49.6,31 180 top
C200  1n  [C0402]  102.7,70.9 90 bottom
C201  1n  [C0402]  98.15,72.95 180 bottom
C202  1n  [C0402]  61.45,74.3 0 bottom
C203  1n  [C0402]  61.45,73.05 0 bottom
C204  3n3  [C0402]  42.5,48.7 0 top
C205  10n  [C0402]  89,61.5 270 bottom
C206  10n  [C0402]  86.4,61.5 270 bottom
C207  10n  [C0402]  87.75,61.5 270 bottom
C208  10n  [C0402]  47.5,29.8 270 top
C209  10n  [C0402]  49.6,30 180 top
C210  10n  [C0402]  49.55,37.1 180 top
C211  10n  [C0402]  50.1,65.85 270 top
C212  10n  [C0402]  84.9,61.55 90 top
C213  10n  [C0402]  82.55,56.05 90 top
C214  10n  [C0402]  86.3,57.65 0 top
C215  10n  [C0402]  39.4,40.45 0 top
C216  10n  [C0402]  90.7,53.35 90 bottom
C217  10n  [C0402]  93.2,59.75 180 top
C218  10n  [C0402]  88,55.7 90 top
C219  10n  [C0402]  50.6,71.9 90 top
C220  10n  [C0603]  130.15,71.8 90 top
C300  100n  [C0402]  92.9,62.9 270 bottom
C301  100n  [C0402]  94.1,62.9 270 bottom
C302  100n  [C0402]  104.75,63.6 180 bottom
C303  100n  [C0402]  104.8,64.85 180 bottom
C304  100n  [C0402]  104.8,66.05 180 bottom
C305  100n  [C0402]  104.8,67.3 180 bottom
C306  100n  [C0402]  108.75,40.35 270 bottom
C307  100n  [C0402]  107.7,40.35 270 bottom
C308  100n  [C0402]  70.65,51.2 270 top
C309  100n  [C0402]  56.95,44.1 270 top
C310  100n  [C0402]  61.05,44.1 270 top
C311  100n  [C0402]  59.85,44.1 270 top
C312  100n  [C0402]  71.95,51.2 270 top
C313  100n  [C0402]  63.55,44.1 270 top
C314  100n  [C0402]  66.1,44.1 270 top
C315  100n  [C0402]  64.85,44.1 270 top
C316  100n  [C0402]  62.3,44.1 270 top
C317  100n  [C0402]  69.45,51.2 270 top
C318  100n  [C0402]  55.75,44.1 270 top
C319  100n  [C0402]  54.5,44.1 270 top
C320  100n  [C0402]  78.9,61.6 270 top
C321  100n  [C0402]  72.9,63.7 270 top
C322  100n  [C0402]  80.2,61.6 270 top
C323  100n  [C0402]  58.15,44.1 270 top
C324  100n  [C0402]  53.25,44.1 270 top
C325  100n  [C0402]  80,50.25 270 bottom
C326  100n  [C0402]  74.2,30.75 180 top
C327  100n  [C0402]  80.25,56.05 90 top
C328  100n  [C0402]  111,39.75 0 top
C329  100n  [C0402]  90.25,20.7 270 top
C330  100n  [C0402]  87.2,17.25 270 top
C331  100n  [C0402]  86.25,17.25 270 top
C332  100n  [C0402]  76.35,25.35 180 top
C333  100n  [C0402]  77,35.75 180 top
C334  100n  [C0402]  75.9,49.35 180 top
C335  100n  [C0402]  86.7,53.5 90 bottom
C336  100n  [C0402]  93.15,53.85 90 bottom
C337  100n  [C0402]  107.8,32.4 0 bottom
C338  100n  [C0402]  102.2,23.85 0 bottom
C339  100n  [C0402]  114.95,67.85 90 bottom
C340  100n  [C0402]  79.85,69 0 top
C341  100n  [C0402]  89.05,57.9 90 top
C342  100n  [C0402]  99.05,20.5 270 top
C343  100n  [C0402]  130.1,55.95 270 bottom
C344  100n  [C0402]  75.35,61.15 0 top
C345  100n  [C0402]  40.7,32.1 270 top
C346  100n  [C0402]  32.65,32.6 180 top
C347  100n  [C0402]  31.7,46.8 90 top
C348  100n  [C0402]  49.55,38.2 180 top
C349  100n  [C0402]  49.6,29 180 top
C350  100n  [C0402]  27.05,68.65 90 top
C351  100n  [C0402]  33.7,68.15 270 top
C352  100n  [C0402]  54.65,68.05 180 top
C353  100n  [C0603]  118.15,33 270 top
C354  100n  [C0402]  81.4,56.05 90 top
C355  100n  [C0402]  77.55,58.8 270 top
C356  100n  [C0402]  55.65,71.9 90 top
C357  100n  [C0603]  124.95,71.8 90 top
C358  100n  [C0402]  33.9,54.25 90 top
C360  100n  [C0402]  43.25,47.85 90 bottom
C361  100n  [C0402]  65.7,47.95 90 bottom
C362  100n  [C0603]  124.1,48.75 180 bottom
C363  100n  [C0402]  76.55,39.8 90 top
C372  100n  [C0603]  119.8,19.95 90 top
C373  100n  [C0603]  34.65,16.85 90 top
C375  100n  [C0603]  36.2,16.85 270 top
C376  100n  [C0402]  85.45,46.15 270 bottom
C377  100n  [C0402]  84.25,37.95 0 bottom
C378  100n  [C0402]  84.25,33.15 0 bottom
C379  100n  [C0402]  71.65,18.35 270 top
C380  100n  [C0603]  90,13.8 270 top
C381  100n  [C0402]  71,12.65 270 top
C382  220n  [C0402]  47.6,52.7 0 top
C383  470n  [C0402]  59,56.4 90 top
C390  100n  [C0402]  111.25,47.6 180 top
C400  1u  [C0402]  131.6,55.95 270 bottom
C401  1u  [C0402]  42.95,47.45 0 top
C402  1u  [C0402]  51.4,65.85 270 top
C403  1u  [C0402]  54.35,58.15 0 top
C404  1u  [C0402]  78.75,58.8 270 top
C405  1u  [C0402]  45.2,55.55 270 top
C407  2u2  [C0402]  75.65,32.1 180 top
C408  2u2 LESR  [C0603]  32.75,37.3 180 top
C409  2u2 LESR  [C0603]  52.05,52.45 0 top
C410  4u7  [C0603]  104.4,19 270 top
C411  4u7  [C0402]  49.6,27.95 180 top
C412  4u7  [C0402]  83.65,56.05 90 top
C413  4u7  [C0402]  86.3,58.7 0 top
C414  4u7  [C0402]  40.25,54.95 0 top
C415  4u7  [C0603]  124.15,50.25 180 bottom
C416  4u7 LESR  [C2012]  91.05,62.2 90 bottom
C417  4u7 LESR  [C2012]  27.45,55.7 0 top
C418  4u7 LESR  [C2012]  121.2,67.4 180 bottom
C419  4u7 LESR  [C2012]  74.85,51.15 0 top
C420  4u7 LESR  [C2012]  74.85,52.95 0 top
C421  4u7 LESR  [C2012]  75.05,57.75 0 top
C422  4u7 LESR  [C2012]  32,54.5 90 top
C423  4u7 LESR  [C2012]  91.85,13.25 270 top
C424  10u  [C2012]  32.2,58.3 270 top
C425  10u  [C2012]  37.85,58.65 90 top
C427  16u  [C2012]  95.55,19.6 180 top
C428  16u  [C2012]  85.8,21.2 180 top
C429  16u  [C2012]  109.85,49.65 90 bottom
C430  100u  [C3225]  39.25,65.35 270 top
C431  100u  [C3225]  48.3,66.25 270 top
C435  16u  [C2012]  41.8,8.85 270 bottom
C437  22u  [C3216]  38.2,34.75 0 top
C438  22u  [C3216]  38.2,37.1 0 top
C439  22u  [C3216]  42.95,39.2 270 top
C440  22u  [C3216]  45.05,39.2 270 top
C441  22u  [C3216]  47.2,39.2 270 top
C442  22u  [C3216]  52.45,21.45 270 top
C443  22u  [C3216]  59.1,21.45 270 top
C444  47u  [C3216]  42.4,31.2 270 top
C445  100u  [SMC_D]  54.55,33.15 90 top
C900  DNP  [C0402]  50.55,63 180 top
C901  DNP  [C0402]  86.3,55.45 0 top
C902  DNP  [C0402]  86.3,56.6 0 top
C1000  100n  [C0402]  156.45,50.05 270 top  (outside the outline)
C1001  100n  [C0402]  156.45,55.8 270 top  (outside the outline)
C1002  100n  [C0402]  151.75,62.8 0 bottom  (outside the outline)
C1003  100n  [C0402]  156.4,44.45 270 top  (outside the outline)
C1004  100n  [C0402]  154.9,61.3 0 bottom  (outside the outline)
C1005  100n  [C0805]  9.99,33.5 270 bottom
C1006  100n  [C0805]  9.54,66.98 270 bottom
D1  ?  [SOD523]  108,61.85 180 top
D2  SS14  [DO-214AC]  98.1,73 90 top
D100  1N4148XHE3  [SOD523]  72.7,61.15 0 top
D101  1N4148XHE3  [SOD523]  29.9,29 0 top
D103  1SS389  [SOD523]  112.05,73.2 270 bottom
D104  1N4148XHE3  [SOD523]  131.55,24.8 0 bottom
D107  1SS389  [SOD523]  55,29.6 0 bottom
D110  BAR63-03W  [SOD323-R]  121.35,69.8 180 bottom
D111  ?  [SOD523]  112.1,57.05 270 bottom
D112  ?  [SOD523]  95.6,62.75 270 bottom
D113  SS14  [DO-214AC]  52.8,55.95 180 top
D115  +/-8V  [DFN1006-2L]  53.05,71.9 180 top
D116  +/-8V  [DFN1006-2L]  127.55,71.8 180 top
D117  +/-8V  [DFN1006-2L]  88.65,13.8 180 top
D118  +/-8V  [DFN1006-2L]  69.8,12.65 180 top
D119  +/-8V  [DFN1006-2L]  80.15,13.6 180 bottom
D120  +/-8V  [DFN1006-2L]  77.7,13.6 180 bottom
D121  +/-8V  [DFN1006-2L]  75.25,13.6 180 bottom
D122  +/-8V  [DFN1006-2L]  74,13.6 180 bottom
D123  +/-8V  [DFN1006-2L]  82.65,13.6 180 bottom
D124  +/-8V  [DFN1006-2L]  81.4,13.6 180 bottom
D900  DNP  [DO-214AC]  67.4,10.4 0 top
D901  DNP  [SOD523]  65.4,12.95 270 bottom
D902  DNP  [DFN1006-2L]  76.45,13.6 180 bottom
D903  DNP  [DFN1006-2L]  78.9,13.6 180 bottom
ENC1000  ALPS EC10E1220503  [APLS_EC10E]  10.72,60.53 180 bottom
F1  1A  [1206]  110.9,12.5 90 top
F100  500mA  [1206]  97.35,13.75 0 top
F101  1A  [1206]  118.5,70.3 270 top
F102  1A5  [1206]  45.25,27.9 90 top
FD1  [FIDUCIAL]  46.3,147.6 0 top
FD2  [FIDUCIAL]  114.1,147.8 0 top
FD100  [FIDUCIAL]  39.3,69 0 top
FD101  [FIDUCIAL]  32.3,42 0 top
FD102  [FIDUCIAL]  118.3,9 0 top
FD103  [FIDUCIAL]  130.3,65 0 top
FD104  [FIDUCIAL]  39.3,69 0 bottom
FD105  [FIDUCIAL]  32.3,42 0 bottom
FD106  [FIDUCIAL]  130.3,65 0 bottom
FD107  [FIDUCIAL]  118.3,9 0 bottom
IC1  C8051F330  [MLP20]  80.15,124.65 180 top
IC2  XC6202P332  [SOT-23]  124.3,55 0 bottom
IC4  MP2672AGD  [MP2672A]  39.5,12.65 0 top
IC5  LSM6DS33  [LGA_3X3_16L]  125.45,67.95 270 top
IC100  STM32F439BIT6  [LQFP208]  93.55,38.3 270 top
IC101  SGM2028-3.3  [SOT23-5]  49.1,33.3 180 top
IC102  SGM2028-3.3  [SOT23-5]  82.55,58.9 270 top
IC103  TPS54228DDA  [HSOP-8]  36.8,46.8 90 top
IC104  AMS1117-5.0  [SOT-223]  29.45,62.95 180 top
IC105  8002A  [SOP-8]  55.2,63.2 0 top
IC106  74LVC1G04DBV  [SOT23-5]  111.45,36.1 180 top
IC107  74LVC1G04DBV  [SOT23-5]  114.75,32.65 270 top
IC108  74LVC1G126DBV  [SOT23-5]  116.1,36.05 90 top
IC109  TLV70033DDC  [SOT23-5]  88.25,61.05 270 top
IC110  TLV70033DDC  [SOT23-5]  37,54.55 270 top
IC111  TPS61161DRV  [WSON6]  46.95,54.9 0 top
IC114  GD25Q127C  [SOP-8_208MIL]  115.75,16.35 0 top
IC116  W9864G6KH-6  [TSOP_II_54]  93.15,38.2 90 bottom
J1  1SH-A-05-GS  [AT_1SH-A-05-XS]  109.5,148.25 270 top
J2  1SH-A-05-GS  [AT_1SH-A-05-XS]  51.15,148.25 90 top
J3  1SH-A-05-GS  [AT_1SH-A-05-XS]  95.3,148.35 270 top
J4  1SH-A-05-GS  [AT_1SH-A-05-XS]  66.15,148.3 90 top
J5  1SH-A-05-GS  [AT_1SH-A-05-XS]  75.2,146.45 0 top
J6  1SH-A-06-GS  [AT_1SH-A-06-XS]  84.35,146.35 0 top
J7  1SH-A-06-XR  [AT_1SH-A-06-XR]  123.3,82.6 180 top
J8  1SH-A-06-XR  [AT_1SH-A-06-XR]  37.75,82.6 180 top
J9  1SH-A-03-GS  [AT_1SH-A-03-XS]  67.9,136.9 0 top
J10  1SH-A-03-GS  [AT_1SH-A-03-XS]  94.05,137 0 top
J11  ZIF FFC 60  [CON-FFC-60-REV]  80.3,90 0 top
J12  FTSH-110-01-L-DV-007-K  [FTSH-110]  108.75,57.5 0 top
J13  0.1" 2x5-pin 90°  [PH2.54-5W2]  106.95,6.5 180 top
J14  53047-04  [MOLEX_53047-04]  122.75,12.2 90 top
J15  53047-02  [MOLEX_53047-02]  28.7,24.2 270 top
J16  53047-05  [MOLEX_53047-05]  132.6,67.7 90 top
J17  53047-06  [MOLEX_53047-06]  132.5,35.9 90 top
J90  B3B-PH-K-S DNP  [JST_B3B_PH-K-S]  87.45,125.65 90 top
J100  ZIF FFC 60  [CON-FFC-60]  80.3,74.05 180 top
J101  53047-02  [MOLEX_53047-02]  46,75 180 top
J102  53047-02  [MOLEX_53047-02]  131.5,23.05 0 top
J103  53047-12  [MOLEX_53047-12]  111.45,75.8 0 top
J104  53047-06  [MOLEX_53047-06]  100.6,72.5 90 top
J105  53047-06  [MOLEX_53047-06]  58.8,72.4 90 top
J106  53047-05  [MOLEX_53047-05]  53.05,75 180 top
J107  53047-05  [MOLEX_53047-05]  127.65,75.65 0 top
J108  ZIF FFC 40  [CON-FFC-40]  54.45,54.2 180 bottom
J109  ZIF FFC 6  [CON-FFC-6]  119.3,49.45 180 bottom
J112  USB-C-16  [USB-C-16]  94.25,3.1 0 top
J113  B3B-XH-A  [JST_B3B-XH-A]  65.5,5.2 0 top
J114  TFWF1  [TFWF1]  74.8,5.15 0 top
J904  B4B-PH-K-S DNP  [JST_B4B_PH-K-S]  74.25,36.9 270 top
J1000  1CH-A-05  [PADS_5_1MM]  109.8,157.95 270 top
J1001  1CH-A-05  [PADS_5_1MM]  50.8,157.95 270 top
J1002  1CH-A-05  [PADS_5_1MM]  95.45,157.95 270 top
J1003  1CH-A-05  [PADS_5_1MM]  65.1,158 270 top
J1004  1CH-A-05  [PADS_5_1MM]  75.2,156.75 0 top  (outside the outline)
J1005  1CH-A-06  [PADS_6_1MM]  84.3,156.75 0 top  (outside the outline)
J1006  1SH-A-06-XR  [AT_1SH-A-06-XR-REV]  149.9,72.7 15 top
J1007  1SH-A-06-XR  [AT_1SH-A-06-XR-REV]  13.77,69.02 315 top
J1008  1CH-A-03  [PADS_3_1MM]  50.3,126.5 0 top
J1009  1CH-A-03  [PADS_3_1MM]  110.3,126.25 0 top
J1010  USB-C-16  [USB-C-16]  91.65,177.8 180 top  (outside the outline)
J1011  PJ-313B  [PJ-313B]  80.15,167.35 0 top  (outside the outline)
J1012  XHP-3  [JST_XHP-3]  65.5,-2.75 180 top
L1  2u2  [PIS2816]  30.5,11.1 180 top
L101  3u6  [0603]  124.2,51.9 0 bottom
L102  3u9  [0603]  75.85,47.55 0 top
L103  4u7  [0603]  93.75,50.7 180 bottom
L104  4u7  [PIS2816]  47.7,45.6 180 top
L105  10u  [L3225M]  28.4,53.35 0 top
L106  10u  [L3225M]  43.15,68.65 180 top
L107  10u  [L3225M]  44.7,65.35 180 top
L108  10u  [0603]  105.8,72.85 270 bottom
L109  10u  [0603]  73.9,55.4 270 top
L110  10u  [0603]  76.1,55.4 270 top
L111  10u  [0603]  35,57.85 0 top
L114  10u  [PIS2816]  44.55,60.2 90 top
LED1  Orange POS1  [SML0603]  105.45,152.35 0 bottom
LED2  Orange POS2  [SML0603]  95.35,152.35 180 bottom
LED3  Orange POS3  [SML0603]  85.35,152.35 0 bottom
LED4  Orange POS4  [SML0603]  75.4,152.35 180 bottom
LED5  Orange POS5  [SML0603]  65.35,152.35 0 bottom
LED6  Orange POS6  [SML0603]  55.3,152.35 180 bottom
LED7  RGB  [PLCC-6]  80.3,108.2 0 bottom
Q1  BC857C  [SOT-23]  115.85,71.85 180 bottom
Q2  NTGS4111P  [TSOP-6]  108,13 0 bottom
Q101  BC847C  [SOT-23]  33.05,30.15 180 top
Q102  BC847C  [SOT-23]  115.85,69.05 0 top
Q103  BC847C  [SOT-23]  107.75,71.75 180 top
Q104  BC847C  [SOT-23]  127.25,58.15 0 bottom
Q106  BC847C  [SOT-23]  110.75,71.75 0 top
Q107  BC847C  [SOT-23]  111.3,52.85 270 bottom
Q108  BC847C  [SOT-23]  97.7,54.05 180 bottom
Q109  BC847C  [SOT-23]  121.85,17.15 0 bottom
Q110  BC847C  [SOT-23]  104.95,14.4 180 top
Q111  BC847C  [SOT-23]  103.1,11.5 270 top
Q117  BC857C  [SOT-23]  54.2,27.35 0 bottom
Q119  SI2301  [SOT-23]  104.55,71.75 0 top
Q121  SI2301  [SOT-23]  112.75,12.15 180 bottom
Q126  NTGS4111P  [TSOP-6]  45.45,33 90 top
Q127  NTGS4111P  [TSOP-6]  37.25,31.95 0 top
Q128  NTGS4111P  [TSOP-6]  118,62.25 270 bottom
R1  22R  [R0402]  90.6,112.7 270 bottom
R2  22R  [R0402]  89.2,112.7 270 bottom
R3  330R  [R0402]  85.6,104.1 270 bottom
R4  330R  [R0402]  84.1,104.1 270 bottom
R5  330R  [R0402]  51,150.2 270 bottom
R6  330R  [R0402]  68,152.35 0 bottom
R7  330R  [R0402]  71.3,149.25 90 bottom
R8  330R  [R0402]  89.35,149.45 90 bottom
R9  330R  [R0402]  92.6,152.35 180 bottom
R10  330R  [R0402]  109.25,150.65 270 bottom
R11  10K  [R0402]  90.4,119.45 0 bottom
R12  0R DNP  [R0402]  106.8,58.15 270 bottom
R13  1K DNP  [R0402]  105.55,55.05 90 bottom
R14  1K DNP  [R0402]  104.35,55.05 90 bottom
R15  1K DNP  [R0402]  105.55,58.15 270 bottom
R16  1K DNP  [R0402]  104.25,58.15 270 bottom
R17  0R DNP  [R0402]  103,58.15 270 bottom
R18  10K DNP  [R0603]  114.1,42.5 90 bottom
R24  0R DNP  [R0402]  118.15,6.75 0 top
R25  22R  [R1206]  45.55,72.5 0 top
R26  6K2  [R0603]  38.25,8.85 90 top
R27  33K  [R0603]  39.1,16.95 270 top
R28  20R  [R2010]  44.15,4.45 270 top
R29  14K5  [R0603]  40.3,8.85 90 bottom
R30  8K2  [R0603]  38.25,8.85 270 bottom
R31  0R  [R0603]  105.5,16.2 270 bottom
R32  22R  [R0603]  29.75,44.95 0 bottom
R33  1K  [R0603]  37.7,16.9 90 top
R34  100K  [R0603]  35.45,8.85 90 top
R35  8K2  [R0603]  39.5,4.45 90 top
R36  100K  [R0603]  40.5,16.95 270 top
R37  4K7  [R0603]  35.35,19.25 180 top
R38  100R  [R0603]  29.9,59.85 270 bottom
R100  0R  [R0402]  111.25,48.6 0 top
R101  0R  [R0603]  43.45,53.35 180 top
R102  1R  [R0402]  50.55,61.6 180 top
R103  1R  [R0402]  101.35,39.9 90 bottom
R104  1R  [R0402]  88.65,16.55 90 top
R105  1R  [R0402]  80.9,18.35 90 top
R106  1R  [R0402]  82.35,18.35 90 top
R107  1R  [R0402]  74.3,18.35 90 top
R108  1R  [R0402]  75.5,18.35 90 top
R109  1R  [R0402]  79.8,18.35 90 top
R110  4R99  [R0805]  46.4,50.9 180 top
R114  33R  [R0402]  77.6,18.35 90 top
R115  51R  [R0402]  89,63.65 270 bottom
R116  51R  [R0402]  86.4,63.65 270 bottom
R117  51R  [R0402]  87.75,63.65 270 bottom
R118  51R  [R0402]  113.7,38.6 180 top
R119  51R  [R0402]  111.5,44.35 0 top
R120  51R  [R0402]  111.5,43.2 0 top
R121  51R  [R0402]  39.4,41.55 0 top
R122  51R  [R0402]  98.15,71.75 0 bottom
R123  51R  [R0402]  103.9,70.9 270 bottom
R124  51R  [R0402]  61.45,71.9 180 bottom
R125  51R  [R0402]  61.45,75.5 180 bottom
R126  51R  [R0402]  95.5,59.75 180 top
R127  51R  [R0402]  71.95,56.1 270 top
R128  51R  [R0402]  51.8,71.9 270 top
R129  51R  [R0603]  128.9,71.8 270 top
R130  51R  [R0402]  66.95,47.95 90 bottom
R131  100R  [R0603]  114.25,72.95 180 top
R132  100R  [R0402]  95.6,60.75 90 bottom
R133  100R  [R0603]  102.05,12.85 270 bottom
R134  100R  [R0603]  103.75,12.85 270 bottom
R135  100R  [R0402]  109.7,2.3 0 bottom
R136  100R  [R0402]  116.45,12.4 270 bottom
R137  100R  [R0402]  115.3,12.4 270 bottom
R138  220R  [R0402]  93.45,66.25 270 top
R139  220R  [R0402]  92.2,66.25 270 top
R140  220R  [R0402]  102.35,63.6 180 bottom
R141  220R  [R0402]  102.35,64.85 180 bottom
R142  220R  [R0402]  102.35,66.05 180 bottom
R143  220R  [R0402]  102.35,67.3 180 bottom
R144  220R  [R0402]  110,45.2 0 bottom
R145  220R  [R0402]  108.3,45.1 270 bottom
R146  220R  [R0402]  70.65,53.65 270 top
R147  220R  [R0402]  56.95,46.45 270 top
R148  220R  [R0402]  61.1,46.45 270 top
R149  220R  [R0402]  59.85,46.45 270 top
R150  220R  [R0402]  71.95,53.65 270 top
R151  220R  [R0402]  63.55,46.45 270 top
R152  220R  [R0402]  66.1,46.45 270 top
R153  220R  [R0402]  64.85,46.45 270 top
R154  220R  [R0402]  62.3,46.45 270 top
R155  220R  [R0402]  69.45,53.65 270 top
R156  220R  [R0402]  55.75,46.45 270 top
R157  220R  [R0402]  54.5,46.45 270 top
R158  220R  [R0402]  78.9,63.95 270 top
R159  220R  [R0402]  90.8,70.25 270 top
R160  220R  [R0402]  80.2,63.95 270 top
R161  220R  [R0402]  58.15,46.45 270 top
R162  220R  [R0402]  53.25,46.45 270 top
R163  220R  [R0402]  80,52.55 270 bottom
R164  220R  [R0402]  54.35,71.9 270 top
R165  220R  [R0603]  126.3,71.8 270 top
R166  330R  [R0402]  75.45,27.9 180 top
R167  330R  [R0402]  120.5,13.2 180 bottom
R204  1K  [R0402]  32.65,34.65 0 top
R205  1K  [R0402]  57.65,56.3 270 top
R206  1K  [R0402]  113.7,39.75 180 top
R207  1K  [R0402]  101.05,20.75 270 top
R208  1K  [R0402]  107.6,68.4 0 top
R209  1K  [R0402]  128.2,51.7 180 bottom
R210  1K  [R0402]  98.3,60.85 0 top
R211  1K  [R0402]  43,55.55 90 top
R212  1K  [R0603]  106.05,19 270 top
R213  1K  [R0603]  102,15.3 270 top
R214  1K  [R0402]  51.45,26.15 180 bottom
R218  2K  [R0402]  96.75,57.05 270 bottom
R219  2K  [R0603]  115.8,48 270 bottom
R220  2K  [R0603]  115.55,52.6 90 bottom
R223  3K6  [R0402]  111.5,45.45 0 top
R224  4K7  [R0402]  75.35,60 0 top
R225  4K7  [R0402]  66.9,51.2 270 top
R226  4K7  [R0402]  68.15,51.2 270 top
R227  4K7  [R0402]  56.6,26.65 270 bottom
R228  5K1  [R0402]  96.7,7.05 0 bottom
R229  5K1  [R0402]  91.75,7.05 180 bottom
R231  7K5  [R0402]  111.5,46.45 180 top
R300  10K  [R0402]  75.9,46.35 0 top
R301  10K  [R0603]  111.6,53.65 180 top
R303  10K  [R0402]  66.9,53.65 90 top
R304  10K  [R0402]  68.15,53.65 90 top
R305  10K  [R0402]  37.65,28.9 0 top
R306  10K  [R0402]  32.65,33.65 0 top
R307  10K  [R0402]  49.55,36.1 180 top
R308  10K  [R0402]  36.85,43.05 180 top
R309  10K  [R0402]  56.8,58.2 0 top
R310  10K  [R0603]  111.4,33.45 0 top
R311  10K  [R0603]  119.25,36.25 270 top
R312  10K  [R0603]  114.25,71.6 180 top
R313  10K  [R0402]  100.4,18.9 0 top
R314  10K  [R0402]  104.6,68.45 180 top
R315  10K  [R0402]  107.6,69.45 0 top
R316  10K  [R0603]  121.35,59.75 0 bottom
R317  10K  [R0402]  128.2,53 180 bottom
R318  1K  [R0402]  113.25,73.2 90 bottom
R319  1K  [R0402]  113.55,67.8 90 bottom
R320  10K  [R0603]  111.15,68.55 180 top
R321  10K  [R0402]  110.9,56.9 90 bottom
R322  10K  [R0402]  109.6,56.9 90 bottom
R323  10K  [R0402]  98.2,50.65 180 bottom
R324  10K  [R0402]  120.45,14.5 180 bottom
R325  10K  [R0402]  79.9,58.8 270 top
R326  10K  [R0603]  120.75,57.7 90 bottom
R327  10K  [R0603]  107.5,13.05 270 top
R328  10K  [R0603]  105.25,16.95 0 top
R330  10K  [R0603]  109,13.05 90 top
R331  10K  [R0603]  99.5,10.65 90 top
R332  10K  [R0402]  118.25,71.05 270 bottom
R333  10K  [R0402]  115.85,74.35 180 bottom
R344  10K  [R0603]  119.7,13.25 270 top
R345  10K  [R0603]  119.8,16.95 90 top
R346  10K  [R0402]  73,18.35 90 top
R347  15K  [R0402]  88.05,57.9 90 top
R348  15K  [R0402]  59,58.55 90 top
R349  20K  [R0402]  58.8,62.85 90 top
R350  22K  [R0402]  42.95,46.35 180 top
R352  39K  [R0402]  39.4,39.3 180 top
R353  47K  [R0402]  75.35,62.15 180 top
R401  100K  [R0402]  46.65,35.3 180 top
R402  100K  [R0402]  39.55,32.1 90 top
R403  100K  [R0402]  104.6,69.45 0 top
R404  100K  [R0603]  118.35,59.75 0 bottom
R405  100K  [R0402]  93.2,59.7 90 bottom
R406  100K  [R0402]  44.15,55.55 90 top
R407  100K  [R0603]  105.5,12.85 90 bottom
R408  100K  [R0603]  112.8,14.75 180 bottom
R411  100K  [R0402]  54.3,24.9 180 bottom
R421  120K  [R0402]  42.95,45.3 0 top
R422  120K  [R0402]  36.7,39.3 180 top
R425  500K  [R0402]  43.75,35.25 180 top
R900  DNP  [R0402]  50.6,59.7 180 top
R901  DNP  [R0603]  119.35,57.7 90 bottom
R902  0R DNP  [R0603]  96.95,10.85 90 top
R903  0R DNP  [R0402]  99.7,18.45 90 bottom
R904  0R DNP  [R0402]  98.55,18.45 90 bottom
R932  0R DNP  [R0603]  106.9,16.2 270 bottom
R1000  220R  [R0402]  157.6,50.05 90 top  (outside the outline)
R1001  220R  [R0402]  157.55,55.8 90 top  (outside the outline)
R1002  220R  [R0402]  154.05,62.8 0 bottom  (outside the outline)
R1003  220R  [R0402]  157.6,44.45 90 top  (outside the outline)
R1004  220R  [R0402]  157.15,61.3 0 bottom  (outside the outline)
R1005  220R  [R0805]  11.94,33.5 90 bottom
R1006  220R  [R0805]  9.54,71.13 270 bottom
R1007  5K1  [R0402]  89.9,170.2 90 top  (outside the outline)
R1008  5K1  [R0402]  92.9,170.2 90 top  (outside the outline)
RN100  51R x4  [EXB38V]  46.05,47.8 0 bottom
RN101  51R x4  [EXB38V]  50.25,47.75 0 bottom
RN102  51R x4  [EXB38V]  54.4,47.8 0 bottom
RN103  51R x4  [EXB38V]  58.5,47.8 0 bottom
RN104  51R x4  [EXB38V]  62.85,47.85 0 bottom
RT1  100K  [NTC_3MM]  41.55,4.9 270 top
S1  [TX16S_BUTTON]  45.3,84 180 bottom
S2  [TX16S_BUTTON]  30.3,84 180 bottom
S3  [TX16S_BUTTON]  62.4,89.2 90 bottom
S4  [TX16S_BUTTON]  62.4,104.2 90 bottom
S5  [TX16S_BUTTON]  98.2,89.2 90 bottom
S6  [TX16S_BUTTON]  98.2,104.2 90 bottom
S7  [TX16S_BUTTON]  130.3,84 0 bottom
S8  [TX16S_BUTTON]  115.3,84 0 bottom
S9  [TX16S_BUTTON]  98.7,123.3 270 bottom
S10  [TX16S_BUTTON]  98.7,138.5 270 bottom
S11  [TX16S_BUTTON]  61.9,123.3 270 bottom
S12  [TX16S_BUTTON]  61.9,138.5 270 bottom
S13  6POS-1  [TX16S_BUTTON]  105.5,148.2 0 bottom
S14  6POS-2  [TX16S_BUTTON]  95.3,148.2 90 bottom
S15  6POS-3  [TX16S_BUTTON]  85.5,148.2 0 bottom
S16  6POS-4  [TX16S_BUTTON]  75.1,148.2 180 bottom
S17  6POS-5  [TX16S_BUTTON]  65.3,148.2 270 bottom
S18  6POS-6  [TX16S_BUTTON]  55.1,148.2 180 bottom
S19  [TX16S_BUTTON]  80.3,115.5 90 bottom
S20  JTP 1236 B  [JTP1236B]  118.15,6.75 0 top
S1000  ON-OFF-ON  [TL3XPO]  119.1,159.95 270 top  (outside the outline)
S1001  ON-OFF-ON  [TL3XPO]  113.55,159.95 270 top  (outside the outline)
S1002  ON-OFF-ON  [TL3XPO]  47.15,159.95 270 top  (outside the outline)
S1003  ON-OFF-ON  [TL3XPO]  41.55,159.95 270 top  (outside the outline)
S1004  ON-OFF-ON  [TL3XPO]  104.8,159.95 270 top  (outside the outline)
S1005  ON-OFF-ON  [TL3XPO]  61.5,160 270 top  (outside the outline)
S1006  ON-ON  [TL3XPO]  99.2,159.95 270 top  (outside the outline)
S1007  ON-MOM  [TL3XPO]  55.9,160 270 top  (outside the outline)
S1008  [TX16S_BUTTON]  155.7,47.4 90 bottom  (outside the outline)
S1009  [TX16S_BUTTON]  155.7,53.15 90 bottom  (outside the outline)
S1010  [TX16S_BUTTON]  152.7,65.1 90 bottom  (outside the outline)
S1011  [TX16S_BUTTON]  155.7,41.85 90 bottom  (outside the outline)
S1012  [TX16S_BUTTON]  155.7,58.9 90 bottom  (outside the outline)
S1013  [TX16S_BUTTON2]  10.7,19 270 bottom
S1014  [TX16S_BUTTON2]  14.6,69.85 0 bottom
TP1  TPSQTP11R  [TP11R]  74.05,111.45 0 top
TP100  TPSQTP11R  [TP11R]  96.5,17.9 0 top
TP101  TPSQTP10R  [TP10R]  121.45,64.55 0 top
TP102  TPSQTP10R  [TP10R]  121.45,63 0 top
TP103  TPSQTP10R  [TP10R]  121.45,61.45 0 top
TP104  TPSQTP10R  [TP10R]  123,60.8 0 top
TP105  TPSQTP10R  [TP10R]  124.65,60.8 0 top
TP113  TPSQTP10R  [TP10R]  95.95,9.15 0 top
TP115  TPSQTP11R  [TP11R]  65.5,8.45 0 top
TP116  TPSQTP11R  [TP11R]  62.9,10.95 0 top
TP1000  TPSQTP11R  [TP11R]  8.2,63 0 top
TP1001  TPSQTP11R  [TP11R]  10.7,63 0 top
TP1002  TPSQTP11R  [TP11R]  13.3,63 0 top
TP1003  TPSQTP11R  [TP11R]  15.85,63 0 top
TP1004  TPSQTP15R  [TP15R]  5,63 0 top
VR1000  10K  [EVUFXL]  50.3,135.5 0 top
VR1001  10K  [EVUFXL]  110.3,135.5 0 top
VR1002  10K  [EVUFXL]  68.15,178.25 0 top  (outside the outline)
VR1003  10K  [EVUFXL]  55.9,178.25 0 top  (outside the outline)
X1  KLBR4  [KLBR4]  52.45,5.9 180 top
Y100  32.768 kHz  [3215]  99.5,56.65 180 top
Y101  12 MHz  [3225]  92.9,57.3 180 top

## Tracks (layer width: path | path; a pad name or v marks a point on that pad's centre or on a via)
5V
  Top 0.406: J12.11 J12.13 106.84,61.85 D1.A
6POS  (via drill 0.3)
  Top 0.254: IC100.36 88.8,54.3 v88.9,54.4
  Bottom 0.254: C207.1 R117.2 87.75,62 88.35,61.4 88.35,59.25 88.9,58.7 v88.9,54.4
6PS1  (via drill 0.3)
  Top 0.254: IC1.12 77.2,125.15 76.85,125.5 76.85,130.95 77.15,131.25 77.95,131.25 v78.4,130.8
  Bottom 0.254: S13.2.1 S13.2.2 104.4,145.3 103.95,144.85 97.65,144.85 96.8,144 92.2,144 91.7,143.5 91.7,136.35 85.75,130.4 78.8,130.4 v78.4,130.8
6PS2  (via drill 0.3)
  Top 0.254: v90.8,144.1 90.8,149.05 v91.95,150.2 | IC1.13 76.85,124.65 76.4,125.1 76.4,131.3 76.95,131.85 79.15,131.85 v79.4,131.6
  Bottom 0.254: S14.2.1 S14.2.2 92.3,149.4 92.15,149.55 92.15,150 v91.95,150.2 | v79.4,131.6 80.1,130.9 85.7,130.9 90.8,136 v90.8,144.1
6PS3  (via drill 0.3)
  Top 0.254: IC1.14 76.35,124.15 75.85,124.65 75.85,135.75 76.3,136.2 v79.5,136.2
  Bottom 0.254: S15.2.1 84.3,149.9 84.7,149.5 84.7,147.55 84.3,147.15 S15.2.2 84.3,145.7 82.05,143.45 82.05,137.7 80.55,136.2 v79.5,136.2
6PS4  (via drill 0.3)
  Top 0.254: IC1.15 76.1,123.65 75.45,124.3 75.45,137.85 v75.9,138.3
  Bottom 0.254: S16.2.2 S16.2.1 76.3,145.25 78.45,143.1 78.45,141.2 79.15,140.5 79.15,139.4 78.05,138.3 v75.9,138.3
6PS5  (via drill 0.3)
  Top 0.254: v64.8,148.9 65.35,148.35 66.35,148.35 v66.7,148 | IC1.16 79.15,120.85 78.7,120.4 76.1,120.4 74.95,121.55 74.95,138.85 76,139.9 76,141.4 76.25,141.65 76.75,141.65 v76.8,141.7
  Bottom 0.254: S17.2.1 63.8,147 64.85,148.05 64.85,148.85 v64.8,148.9 | v66.7,148 67.5,147.2 S17.2.2 68.05,147 69.85,145.2 69.85,144.75 71.85,142.75 74.1,142.75 75.2,141.65 76.75,141.65 v76.8,141.7
6PS6  (via drill 0.3)
  Top 0.254: IC1.17 79.65,120.6 79,119.95 75.9,119.95 74.5,121.35 74.5,139.4 v74.8,139.7
  Bottom 0.254: S18.2.2 S18.2.1 56.65,146.45 61.15,146.45 62.15,145.45 65.35,145.45 67.45,143.35 68.9,143.35 70.95,141.3 73.3,141.3 74.8,139.8 v74.8,139.7
!CHG_CTR  (via drill 0.3)
  Top 0.254: v91.95,35.9 92.4,36.35 98.2,36.35 99.2,35.35 104.65,35.35 106.35,37.05 IC100.180 | 59.65,28.5 v59.6,28.55 | IC4.16 39.5,14.6 40.5,15.6 R36.2 56.65,16.1 v57.55,17
  Route2 0.254: v59.6,28.55 57.55,26.5 v57.55,17
  Route3 0.254: v59.6,28.55 60.9,29.85 75.75,29.85 79.3,33.4 89.45,33.4 v91.95,35.9
  Bottom 0.254: v59.6,28.55 59.25,28.2 56.9,28.2 56.6,27.9 R227.1
!RST  (via drill 0.3)
  Top 0.254: R347.1 C341.1 89.8,56.5 IC100.34 89.8,52.15 v90,51.75 | J12.10 109.38,53.98 v108.95,53.55
  Route2 0.254: v108.95,53.55 93.15,53.55 92.55,52.95 91.1,52.95 v90,51.75
+5V  (via drill 0.3, 0.5)
  Top 0.254: R403.2 105.25,70.4 Q119.2 | 34.45,57.9 34.4,57.9 | R312.2 v113.15,70.85 | L111.1 34.27,57.98 34.27,58.02 | R421.2 43.6,45.15 | R307.1 50.23,36.1
  Top 0.406: 43.6,45.15 v43.95,44.8 43.6,44.45 C102.1 | D1.C v110.3,61.85
  Top 0.61: IC110.1 36.35,55.5 36.8,55.05 36.8,53.85 36.55,53.6 IC110.3 C358.1 v33.15,53.6 | Q119.2 104.4,71.75 102.9,71.75 102.4,71.25 v102.4,68.8 101.95,68.35 99.3,68.35 98.1,69.55 D2.C | C424.1 33.15,59.15 34.27,58.02 34.4,57.9 34.4,56.05 34.95,55.5 IC110.1 | 35.66,55.45 IC110.1 | C419.1 73.95,51.2 v73.95,51.95 73.95,52.9 C420.1 L109.2 | C441.1 47.85,39.95 47.85,39.9 48.55,39.2 49.85,39.2 50.2,38.85 C348.1 C210.1 50.23,36.1 50.23,35.9 | 50.23,35.9 v50.25,35.4 | IC101.1 50.23,34.77 50.23,35.9
  Top 0.813: C422.1 32.05,53.6 v33.15,53.6
  Top 1.016: L104.1 C441.1 C440.1 v43.95,40.6 C439.1
  Top 1.27: F100.1 95.15,13.75 | 95.15,13.75 v94.65,14.25 v94.65,13.3 | 95.15,13.75 95.1,13.75
  Route2 0.813: v43.95,44.8 43.95,46.2 49.7,51.95 v73.95,51.95 74.05,51.95 78.55,56.45 91,56.45 91.85,57.3 v91.85,61.4 91.85,61.65 95.4,61.65 102.4,68.65 v102.4,68.8
  Route2 1.27: v94.65,13.3 94.65,14.35 87.85,14.35 87.05,13.55 v66.35,13.55 52.4,13.55 49.85,16.1 49.85,24.45 | 49.85,24.45 52.55,27.15 52.55,33.1 v51.85,33.8 v51.1,34.55 v50.25,35.4 | J15.2 30.45,26.58 arc-45 31.35,26.95 38.5,26.95 40.63,24.82 arc45 41.53,24.45 49.85,24.45
  Route3 0.406: v124.3,58.8 125.4,58.8 129.83,63.23
  Route3 0.61: v102.4,68.8 103.75,67.45 106.45,67.45 108.35,65.55 | 108.35,65.55 110.3,63.6 v110.3,61.85 | 108.35,65.55 109.05,66.25 111.6,66.25 112.2,65.65 116.9,65.65 v116.9,66.35 126.7,66.35 129.83,63.23 130.3,62.75 | 130.3,62.75 133.1,59.95 133.1,43.7 | J16.5 130.3,62.9 130.3,62.75
  Route3 0.813: J102.1 134.15,25.07 134.15,32.7 | 134.15,32.7 134.15,42.65 133.1,43.7 | J17.6 134.09,32.77 134.15,32.7
  Bottom 0.254: v113.15,70.85 114.3,69.7 116.5,69.7 116.9,69.3 v116.9,66.35 | C416.1 91.05,61.4 v91.85,61.4
  Bottom 0.406: D901.C v66.35,13.55 | IC2.3 v124.3,58.8
  Bottom 0.61: v43.95,44.8 40.8,44.8 33.15,52.45 v33.15,53.6
  Bottom 0.813: v43.95,40.6 v43.95,44.8 | D104.C 132.12,24.77 J102.1
AUDIO_5V
  Top 0.61: IC104.4 29.35,59.95 29.35,66.05 IC104.2 29.35,66.15 29.35,68.2 30.15,69 33.7,69 C351.1 33.9,69 36.15,69 38.7,66.45 C430.1 41.75,66.85 L106.2
AUDIO_GND  (via drill 0.3)
  Top 0.254: R309.1 v55.55,58.05 | C900.2 50,63 50.05,63.05
  Top 0.305: C403.2 55.1,58.05 v55.55,58.05
  Top 0.406: 54.45,64.25 v54.45,64.1 | C352.2 54,67.6 54.55,67.05 54.55,66.22 IC105.7 | C402.2 51.6,65.2 | 50.05,63.05 49.85,63.25 49.85,64.25
  Top 0.61: IC105.7 54.56,64.25 v53.95,64.25 | 51.6,65.2 52.55,64.25 v53.95,64.25 | C402.2 C211.2 49.65,65.2 48.85,64.4 C431.2 47.8,65.35 L107.1 | 48.8,64.25 49.85,64.25 v53.95,64.25
  Bottom 0.406: v55.55,58.05 55.55,63 v54.45,64.1 54.3,64.25 v53.95,64.25
  Bottom 0.61: A1.GND 31.15,42.6 31.15,45 | 31.15,45 31.15,57.4 32.1,58.35 39.05,58.35 44.95,64.25 v53.95,64.25 | R32.1 30.65,45 31.15,45
  pour Top (no thermals): 56.9,62.05 56.9,64.15 53.8,64.15 53.8,62.05
AUDIO_MUTE  (via drill 0.3)
  Top 0.254: IC100.56 77.5,49.55 v77.45,49.6
  Top 0.406: R205.2 v58.15,55.65
  Route3 0.254: v58.15,55.65 58.55,55.25 65.6,55.25 70.15,50.7 75.95,50.7 77.05,49.6 v77.45,49.6
AUDIO_OUT  (via drill 0.3)
  Top 0.254: IC100.53 78.5,51.05 78.15,51.4 v78.15,51.75 | C383.1 v59.6,55.9
  Route3 0.254: v59.6,55.9 65.6,55.9 70.35,51.15 75.9,51.15 76.9,52.15 77.75,52.15 v78.15,51.75
AUX1_PWR
  Top 0.254: IC100.151 103.8,22.25 105.9,20.15 R212.1
AUX1_RX  (via drill 0.3)
  Top 0.254: IC100.91 77.4,32.05 75.55,33.9 J904.4
  Route2 0.254: J904.4 72.35,33.9 64.65,26.2 64.65,20.1 65.15,19.6 68,19.6 69.45,18.15 70.5,16.9 v70.5,15.75
  Bottom 0.254: v70.5,15.75 100,15.75 R133.1
AUX1_TX  (via drill 0.3)
  Top 0.254: IC100.90 77.6,32.55 J904.3
  Route2 0.254: J904.3 73.7,35.9 64.15,26.35 64.15,19.9 64.95,19.1 67.65,19.1 68.95,17.8 v69.7,16.45
  Bottom 0.254: v69.7,16.45 101,16.45 R134.1
AUX2_EN  (via drill 0.3)
  Top 0.254: IC100.179 109,36.55 109.55,36 | 109.55,36 109.65,35.9 115.3,35.9 116.15,36.75 116.15,37.7 116.45,38 120.2,38 124.19,34.02 J17.5 | v109.75,36.1 109.65,36 109.55,36
  Route2 0.254: v116,15.1 105.85,25.25 105.85,28.6 104.4,30.05 104.4,34.3 106.2,36.1 v109.75,36.1
  Bottom 0.254: R135.1 113.65,2.3 114.7,1.25 123.35,1.25 124.65,2.55 124.65,16.15 123.65,17.15 118.05,17.15 v116,15.1
AUX2_IO
  Bottom 0.254: J17.4 120.48,35.27 R18.1
AUX2_PWR  (via drill 0.3)
  Top 0.254: IC100.61 80.85,47.05 81.15,46.7 81.3,46.55 81.3,43.95 v80.6,43.25 | v94.7,17.4 95.95,16.15 R213.1
  Route2 0.254: v80.6,43.25 76,43.25 62.9,30.15 62.9,19.6 64.15,18.35 66.6,18.35 70.3,14.65 70.65,14.65 72.05,16.05 93.35,16.05 v94.7,17.4
AUX2_RX  (via drill 0.3)
  Top 0.254: IC100.178 108.95,36.05 v109.75,35.25
  Route2 0.254: v109.75,35.25 109.8,35.2 111.1,35.2 111.6,34.3 111.6,28.5 113.6,26.9 v115.8,26.9 118.6,26.9 129.47,37.77 J17.2
  Bottom 0.254: R136.1 116.45,13.75 115.4,14.8 115.4,26.5 v115.8,26.9
AUX2_TX  (via drill 0.3)
  Top 0.254: IC100.183 v109.7,38.55
  Route2 0.254: v109.7,38.55 109.7,38.15 112.9,34.75 112.9,29 114.3,27.8 | 114.3,27.8 v114.35,27.75 | v114.35,27.75 v114.34,27.75 114.3,27.8 | J17.3 133.27,36.52 133.95,37.2 133.95,39.25 133.25,39.95 130.6,39.95 118.4,27.75 v114.35,27.75
  Bottom 0.254: R137.1 114.85,13.5 114.85,27.25 v114.35,27.75
AUX_5V  (via drill 0.5)
  Top 1.27: F100.2 99.65,13.75 v100.1,14.2 v100.1,13.35
  Route2 1.27: v100.1,13.35 100.1,14.15 109.6,14.15 113.9,9.85 v113.9,9.05
  Bottom 0.406: 113.75,12.65 113.75,13.2 Q121.2
  Bottom 0.61: Q121.2 113.7,14.7 R408.2
  Bottom 0.813: Q121.2 113.9,13.05 v113.9,10 v113.9,9.05 | R932.1 112.5,17.05 113.65,15.9 R408.2
BACKLIGHT_A  (via drill 0.3)
  Top 0.406: C409.1 51.2,52.6 52.6,54 52.6,55.4 v53.35,56.15
  Top 0.61: D113.C 54.65,56.15 v53.35,56.15
  Bottom 0.254: J108.2 45.28,55.38 47.7,57.8 50.8,57.8 52.45,56.15 v53.35,56.15
BACKLIGHT_C  (via drill 0.3)
  Top 0.254: 45.55,51 R110.2
  Top 0.406: 45.55,51 44.85,51 v44,51.85
  Top 0.61: 45.55,51 45.55,53.5 45.92,53.88 IC111.1
  Bottom 0.406: J108.1 44.55,52.4 v44,51.85
BO_6POS_ANA  (via drill 0.3)  (1 unrouted)